# EasyEDA Pro project Electonic_keyboard.eprj

# Schematic Electonic Keyboard
Create Date: 2023-12-27; Page Name: P1; Project Name: Electonic_keyboard; Schematic Name: Electonic Keyboard; Update Date: 2024-01-06; Company: 嘉立创EDA; Drawed: Cameron Bright; Page Size: A4; Reviewed: Cameron Bright; Version: V1.0
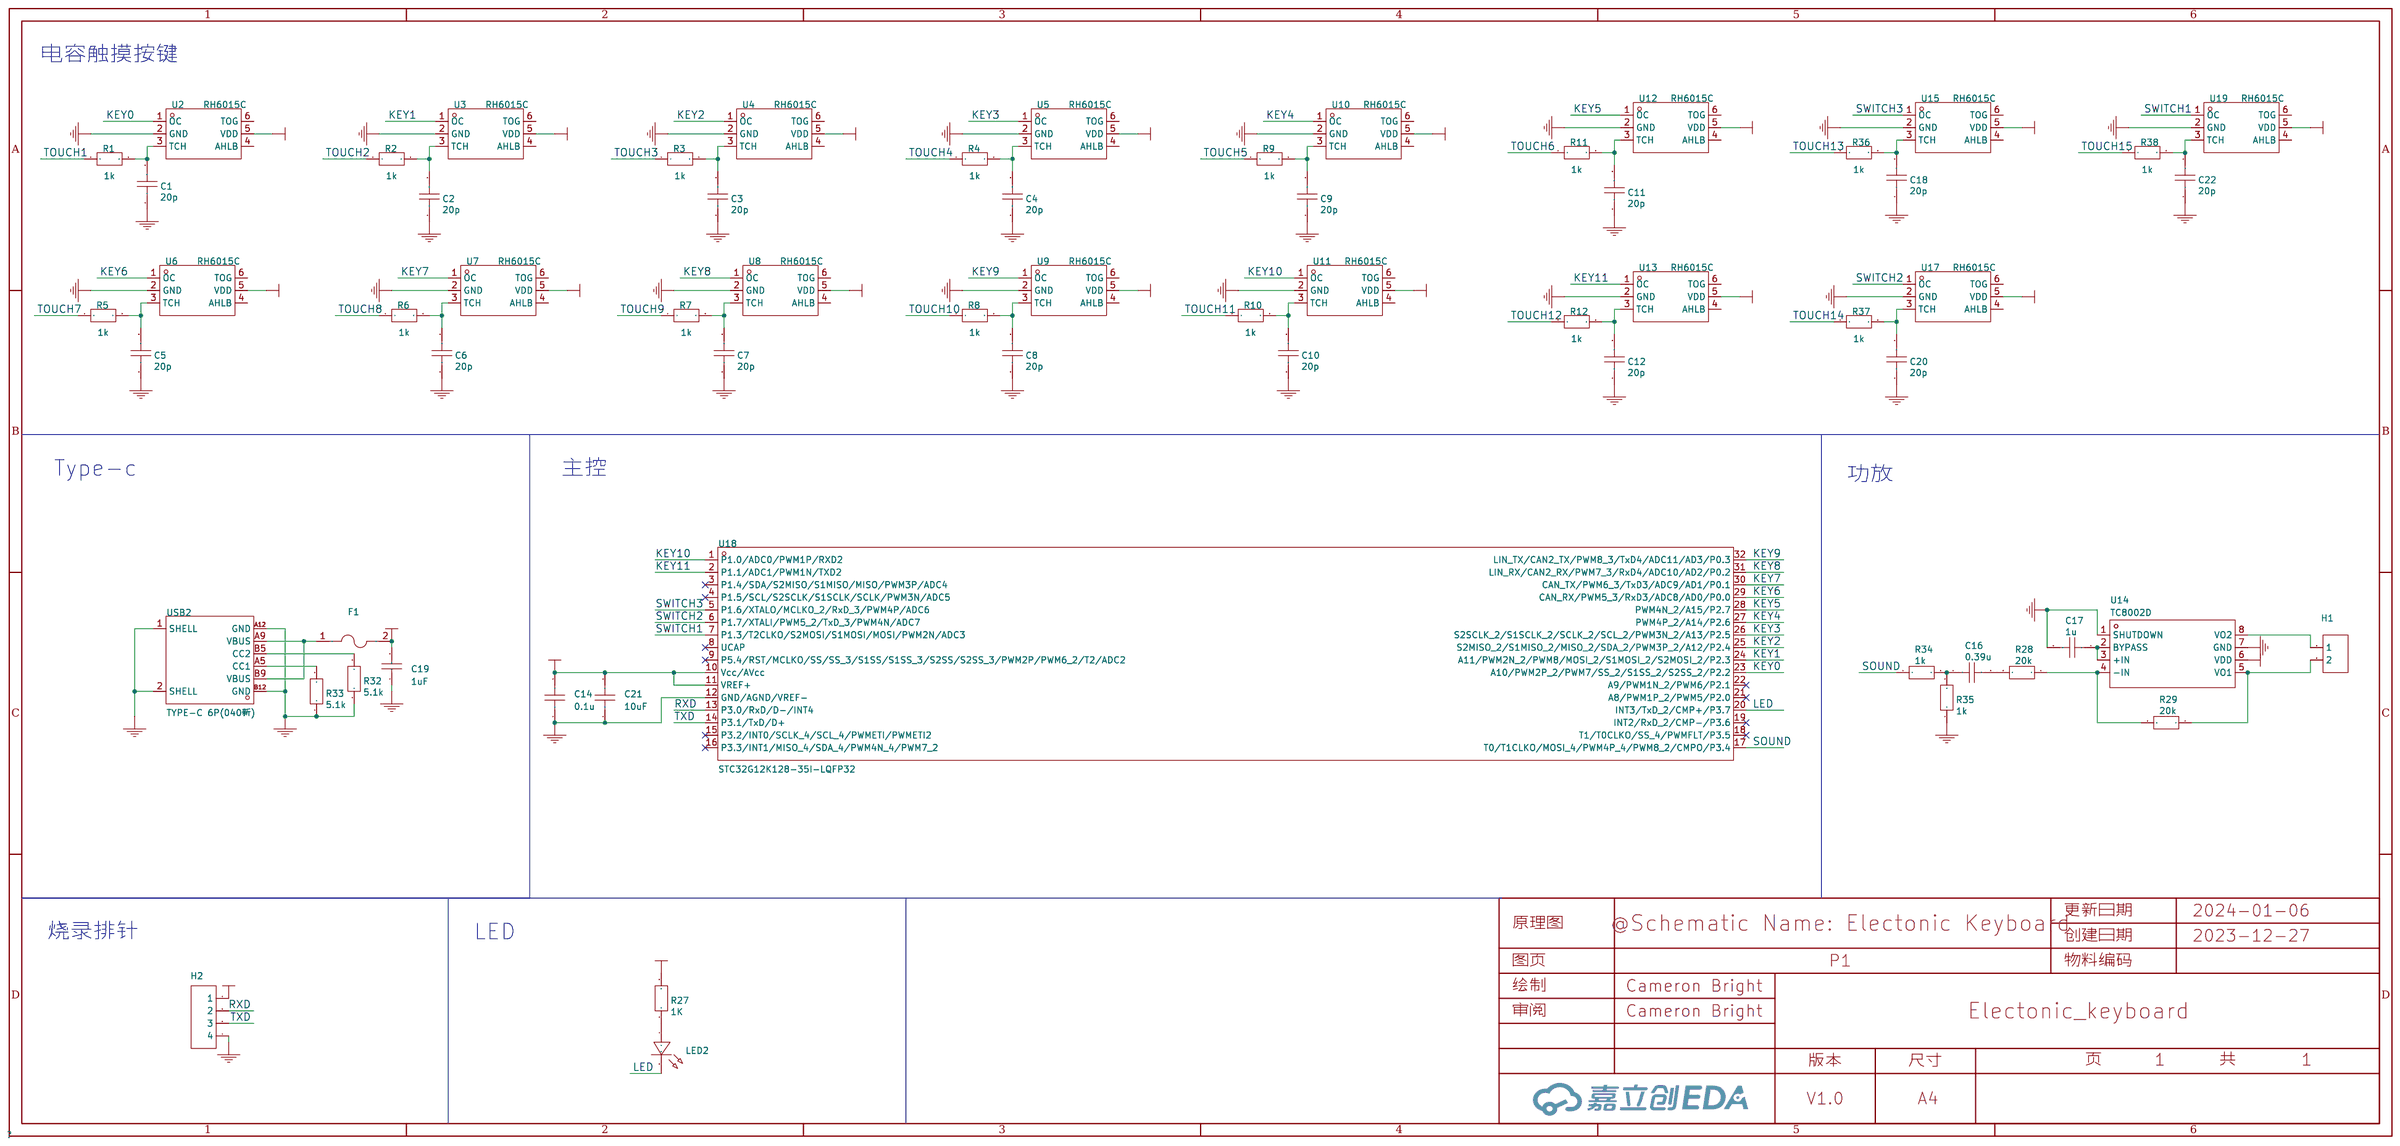
[diagram p0: schematic sheet]

## Parts
C1  20p  [C0603]
C2  20p  [C0603]
C3  20p  [C0603]
C4  20p  [C0603]
C5  20p  [C0603]
C6  20p  [C0603]
C7  20p  [C0603]
C8  20p  [C0603]
C9  20p  [C0603]
C10  20p  [C0603]
C11  20p  [C0603]
C12  20p  [C0603]
C14  0.1u  [C0603]
C16  0.39u  [C0603]
C17  1u  [C0603]
C18  20p  [C0603]
C19  1uF  [C0603]
C20  20p  [C0603]
C21  10uF  [C0603]
C22  20p  [C0603]
F1  ASMD0805-050  [F0805]
H1  HDR-F-2.54_1x2  [HDR-F-2.54_1X2]
H2  HDR-F-2.54_1x4  [HDR-F-2.54_1X4]
LED2  NCD0603R1  [LED0603-RD_RED]
R1  1k  [C0603]
R2  1k  [C0603]
R3  1k  [C0603]
R4  1k  [C0603]
R5  1k  [C0603]
R6  1k  [C0603]
R7  1k  [C0603]
R8  1k  [C0603]
R9  1k  [C0603]
R10  1k  [C0603]
R11  1k  [C0603]
R12  1k  [C0603]
R27  1K  [C0603]
R28  20k  [C0603]
R29  20k  [C0603]
R32  5.1k  [C0603]
R33  5.1k  [C0603]
R34  1k  [C0603]
R35  1k  [C0603]
R36  1k  [C0603]
R37  1k  [C0603]
R38  1k  [C0603]
U2  RH6015C  [SOT-23-6_L2.9-W1.6-P0.95-LS2.8-BR]
U3  RH6015C  [SOT-23-6_L2.9-W1.6-P0.95-LS2.8-BR]
U4  RH6015C  [SOT-23-6_L2.9-W1.6-P0.95-LS2.8-BR]
U5  RH6015C  [SOT-23-6_L2.9-W1.6-P0.95-LS2.8-BR]
U6  RH6015C  [SOT-23-6_L2.9-W1.6-P0.95-LS2.8-BR]
U7  RH6015C  [SOT-23-6_L2.9-W1.6-P0.95-LS2.8-BR]
U8  RH6015C  [SOT-23-6_L2.9-W1.6-P0.95-LS2.8-BR]
U9  RH6015C  [SOT-23-6_L2.9-W1.6-P0.95-LS2.8-BR]
U10  RH6015C  [SOT-23-6_L2.9-W1.6-P0.95-LS2.8-BR]
U11  RH6015C  [SOT-23-6_L2.9-W1.6-P0.95-LS2.8-BR]
U12  RH6015C  [SOT-23-6_L2.9-W1.6-P0.95-LS2.8-BR]
U13  RH6015C  [SOT-23-6_L2.9-W1.6-P0.95-LS2.8-BR]
U14  TC8002D  [SOIC-8_L5.0-W4.0-P1.27-LS6.0-BL]
U15  RH6015C  [SOT-23-6_L2.9-W1.6-P0.95-LS2.8-BR]
U17  RH6015C  [SOT-23-6_L2.9-W1.6-P0.95-LS2.8-BR]
U18  STC32G12K128-35I-LQFP32  [LQFP-32_L7.0-W7.0-P0.80-LS9.0-BL]
U19  RH6015C  [SOT-23-6_L2.9-W1.6-P0.95-LS2.8-BR]
USB2  TYPE-C 6P(040新)  [USB-C-SMD_TYPE-C-6P]

## Library data of the parts
C1-C12 C18 C20 C22 = 20p
C14 = 0.1u
C16 = 0.39u
C17 = 1u
C19 = CL10A105KB8NNNC: 容值:1uF;精度:±10%;额定电压:50V;材质(温度系数):X5R;; LCSC Part Name: 1uF ±10% 50V; Supplier Part: C15849; Manufacturer: SAMSUNG(三星); Supplier Footprint: 0603; JLCPCB Part Class: 基础库; Datasheet: https://atta.szlcsc.com/upload/public/pdf/source/20160218/1457707763339.pdf; Supplier: LCSC; Tolerance: ±10%; Voltage Rated: 50V; Temperature Coefficient: X5R
C21 = CAP_0603: Supplier Footprint: 0603
F1 = ASMD0805-050: 最大电压:6V;最大电流:100A;保持电流:500mA;跳闸电流:1A;; LCSC Part Name: 6V 500mA 0805自恢复; Supplier Part: C135329; Manufacturer: JDTfuse(集电通); Supplier Footprint: 0805; JLCPCB Part Class: Extended Part; Datasheet: https://atta.szlcsc.com/upload/public/pdf/source/20171014/C135329_15079756460221038400.pdf; Supplier: LCSC; Operating Voltage (Max): 6V; Current Rating (Max): 100A; Hold Current: 500mA; Trip Current: 1A; Power Dissipation: 500mW; Resistance - Initial (Ri) (Min): 150mΩ; Resistance - Post Trip (R1) (Max): 850mΩ; Maximum Time to Trip: 100ms; Operating Temperature: -40℃~+85℃
H1 = HDR-F-2.54_1x2: Supplier Part: C49661; Supplier: LCSC
H2 = HDR-F-2.54_1x4: Supplier Part: C225501; Supplier: LCSC
LED2 = NCD0603R1_C84263: 发光颜色:红色;功率:65mW;透镜颜色:无色透明;主波长:615nm~630nm;发光强度:80mcd~220mcd;发光角度:130°;工作温度:-30℃~+85℃;; LCSC Part Name: 红灯 0603红灯   正贴; Supplier Part: C84263; Manufacturer: 国星光电; Supplier Footprint: 0603; JLCPCB Part Class: Extended Part; Datasheet: https://atta.szlcsc.com/upload/public/pdf/source/20200820/C84263_DABC6A75E58F576973B407FDBA283D60.pdf; Supplier: LCSC; Emitted Color: 红色; Forward Voltage (VF): 1.6V~2.6V; Forward Current: 20mA; Power Dissipation: 65mW; Lens Color: 无色透明; Dominant Wavelength: 615nm~630nm; Luminous Intensity: 80mcd~220mcd; Viewing Angle: 130°; Operating Temperature: -30℃~+85℃
R1-R12 R34-R38 = 1k
R27 = 1K
R28 R29 = 20k
R32 R33 = 5.1k
U2-U13 U15 U17 U19 = RH6015C: Supplier: LCSC; Supplier Part: C161821; Manufacturer: RONGHE Microelectronics; JLCPCB Part Class: Extend
U14 = TC8002D: 功放类型:-;扬声器通道数:1通道(单声道);输出功率:3Wx1@3Ω;; Supplier Part: C87265; Manufacturer: FM(富满); Supplier Footprint: SOIC-8; JLCPCB Part Class: Extended Part; Datasheet: https://atta.szlcsc.com/upload/public/pdf/source/20161123/1479873101876.pdf; Supplier: LCSC; Speaker Channels: 1通道(单声道); Output Power: 3Wx1@3Ω; Supply Voltage: 2V~5.5V
U18 = STC32G12K128-35I-LQFP32: Supplier Part: C5210759; Manufacturer: STC(宏晶); Supplier Footprint: LQFP-32(7x7); JLCPCB Part Class: 扩展库; Datasheet: https://atta.szlcsc.com/upload/public/pdf/source/20230914/AA8E7D278420EC7FE3821FDFD9AB7FC5.pdf; Supplier: LCSC
USB2 = TYPE-C 6P(040新): 连接器类型:Type-C;标准:-;公母:母;端口数量:1;触点数量:6P;安装方式:卧贴;额定电流 - 电源:3A;工作温度范围:-40℃~+85℃;; LCSC Part Name: Type-C 母 卧贴 外壳带丝印; Supplier Part: C2887422; Manufacturer: SHOU HAN(首韩); Supplier Footprint: SMD; JLCPCB Part Class: 扩展库; Datasheet: https://atta.szlcsc.com/upload/public/pdf/source/20210820/A6D4675B44FEA528A0512D7C06DEA92E.pdf; Supplier: LCSC; Connector Type: Type-C; Gender: 母; Number of Ports: 1; Number of Contacts: 6P; Mounting Style: 卧贴; Current Rating - Power (Max): 3A; Operating Temperature Range: -40℃~+85℃

## Nets
GND: C1.1 C2.1 C3.1 C4.1 C5.1 C6.1 C7.1 C8.1 C9.1 C10.1 C11.1 C12.1 C14.1 C17.2 C18.1 C19.1 C20.1 C21.1 C22.1 H2.4 R32.1 R33.1 R35.1 U2.2(GND) U3.2(GND) U4.2(GND) U5.2(GND) U6.2(GND) U7.2(GND) U8.2(GND) U9.2(GND) U10.2(GND) U11.2(GND) U12.2(GND) U13.2(GND) U14.1(SHUTDOWN) U14.7(GND) U15.2(GND) U17.2(GND) U18.12(GND/AGND/VREF-) U19.2(GND) USB2.1(SHELL) USB2.2(SHELL) USB2.A12(GND) USB2.B12(GND)
VCC: C14.2 C19.2 C21.2 F1.2 H2.1 R27.2 U2.5(VDD) U3.5(VDD) U4.5(VDD) U5.5(VDD) U6.5(VDD) U7.5(VDD) U8.5(VDD) U9.5(VDD) U10.5(VDD) U11.5(VDD) U12.5(VDD) U13.5(VDD) U14.6(VDD) U15.5(VDD) U17.5(VDD) U18.10(Vcc/AVcc) U18.11(VREF+) U19.5(VDD)
KEY0: U2.1(OC) U18.23(A10/PWM2P_2/PWM7/SS_2/S1SS_2/S2SS_2/P2.2)
KEY1: U3.1(OC) U18.24(A11/PWM2N_2/PWM8/MOSI_2/S1MOSI_2/S2MOSI_2/P2.3)
KEY2: U4.1(OC) U18.25(S2MISO_2/S1MISO_2/MISO_2/SDA_2/PWM3P_2/A12/P2.4)
KEY3: U5.1(OC) U18.26(S2SCLK_2/S1SCLK_2/SCLK_2/SCL_2/PWM3N_2/A13/P2.5)
KEY4: U10.1(OC) U18.27(PWM4P_2/A14/P2.6)
KEY5: U12.1(OC) U18.28(PWM4N_2/A15/P2.7)
KEY6: U6.1(OC) U18.29(CAN_RX/PWM5_3/RxD3/ADC8/AD0/P0.0)
KEY7: U7.1(OC) U18.30(CAN_TX/PWM6_3/TxD3/ADC9/AD1/P0.1)
KEY8: U8.1(OC) U18.31(LIN_RX/CAN2_RX/PWM7_3/RxD4/ADC10/AD2/P0.2)
KEY9: U9.1(OC) U18.32(LIN_TX/CAN2_TX/PWM8_3/TxD4/ADC11/AD3/P0.3)
KEY10: U11.1(OC) U18.1(P1.0/ADC0/PWM1P/RXD2)
KEY11: U13.1(OC) U18.2(P1.1/ADC1/PWM1N/TXD2)
LED: LED2.2 U18.20(INT3/TxD_2/CMP+/P3.7)
RXD: H2.2 U18.13(P3.0/RxD/D-/INT4)
SOUND: R34.1 U18.17(T0/T1CLKO/MOSI_4/PWM4P_4/PWM8_2/CMPO/P3.4)
SWITCH1: U18.7(P1.3/T2CLKO/S2MOSI/S1MOSI/MOSI/PWM2N/ADC3) U19.1(OC)
SWITCH2: U17.1(OC) U18.6(P1.7/XTALI/PWM5_2/TxD_3/PWM4N/ADC7)
SWITCH3: U15.1(OC) U18.5(P1.6/XTALO/MCLKO_2/RxD_3/PWM4P/ADC6)
TOUCH1: R1.1
TOUCH2: R2.1
TOUCH3: R3.1
TOUCH4: R4.1
TOUCH5: R9.1
TOUCH6: R11.1
TOUCH7: R5.1
TOUCH8: R6.1
TOUCH9: R7.1
TOUCH10: R8.1
TOUCH11: R10.1
TOUCH12: R12.1
TOUCH13: R36.1
TOUCH14: R37.1
TOUCH15: R38.1
TXD: H2.3 U18.14(P3.1/TxD/D+)
$1N1124: C1.2 R1.2 U2.3(TCH)
$1N1133: C2.2 R2.2 U3.3(TCH)
$1N1138: C3.2 R3.2 U4.3(TCH)
$1N1145: C4.2 R4.2 U5.3(TCH)
$1N1152: C5.2 R5.2 U6.3(TCH)
$1N1159: C6.2 R6.2 U7.3(TCH)
$1N1166: C7.2 R7.2 U8.3(TCH)
$1N1173: C8.2 R8.2 U9.3(TCH)
$1N1180: C9.2 R9.2 U10.3(TCH)
$1N1187: C10.2 R10.2 U11.3(TCH)
$1N1448: C11.2 R11.2 U12.3(TCH)
$1N1455: C12.2 R12.2 U13.3(TCH)
$1N1642: R33.2 USB2.A5(CC1)
$1N1644: F1.1 USB2.A9(VBUS) USB2.B9(VBUS)
$1N1645: R32.2 USB2.B5(CC2)
$1N1710: LED2.1 R27.1
$1N2160: H1.2 R29.1 U14.5(VO1)
$1N2161: R28.1 R29.2 U14.4(-IN)
$1N2162: H1.1 U14.8(VO2)
$1N2164: C17.1 U14.2(BYPASS) U14.3(+IN)
$1N2169: C16.1 R34.2 R35.2
$1N2171: C16.2 R28.2
$1N8905: C18.2 R36.2 U15.3(TCH)
$1N12216: C20.2 R37.2 U17.3(TCH)
$1N14986: C22.2 R38.2 U19.3(TCH)

Not connected (* = marked no-connect by the designer): U2 4(AHLB) 6(TOG); U3 4(AHLB) 6(TOG); U4 4(AHLB) 6(TOG); U5 4(AHLB) 6(TOG); U6 4(AHLB) 6(TOG); U7 4(AHLB) 6(TOG); U8 4(AHLB) 6(TOG); U9 4(AHLB) 6(TOG); U10 4(AHLB) 6(TOG); U11 4(AHLB) 6(TOG); U12 4(AHLB) 6(TOG); U13 4(AHLB) 6(TOG); U15 4(AHLB) 6(TOG); U17 4(AHLB) 6(TOG); U18 3(P1.4/SDA/S2MISO/S1MISO/MISO/PWM3P/ADC4)* 4(P1.5/SCL/S2SCLK/S1SCLK/SCLK/PWM3N/ADC5)* 8(UCAP)* 9(P5.4/RST/MCLKO/SS/SS_3/S1SS/S1SS_3/S2SS/S2SS_3/PWM2P/PWM6_2/T2/ADC2)* 15(P3.2/INT0/SCLK_4/SCL_4/PWMETI/PWMETI2)* 16(P3.3/INT1/MISO_4/SDA_4/PWM4N_4/PWM7_2)* 18(T1/T0CLKO/SS_4/PWMFLT/P3.5)* 19(INT2/RxD_2/CMP-/P3.6)* 21(A8/PWM1P_2/PWM5/P2.0)* 22(A9/PWM1N_2/PWM6/P2.1)*; U19 4(AHLB) 6(TOG)

## Notes on the sheet
- 电容触摸按键
- Type-c
- 主控
- 功放
- 烧录排针
- LED

# Schematic 迷你电子琴
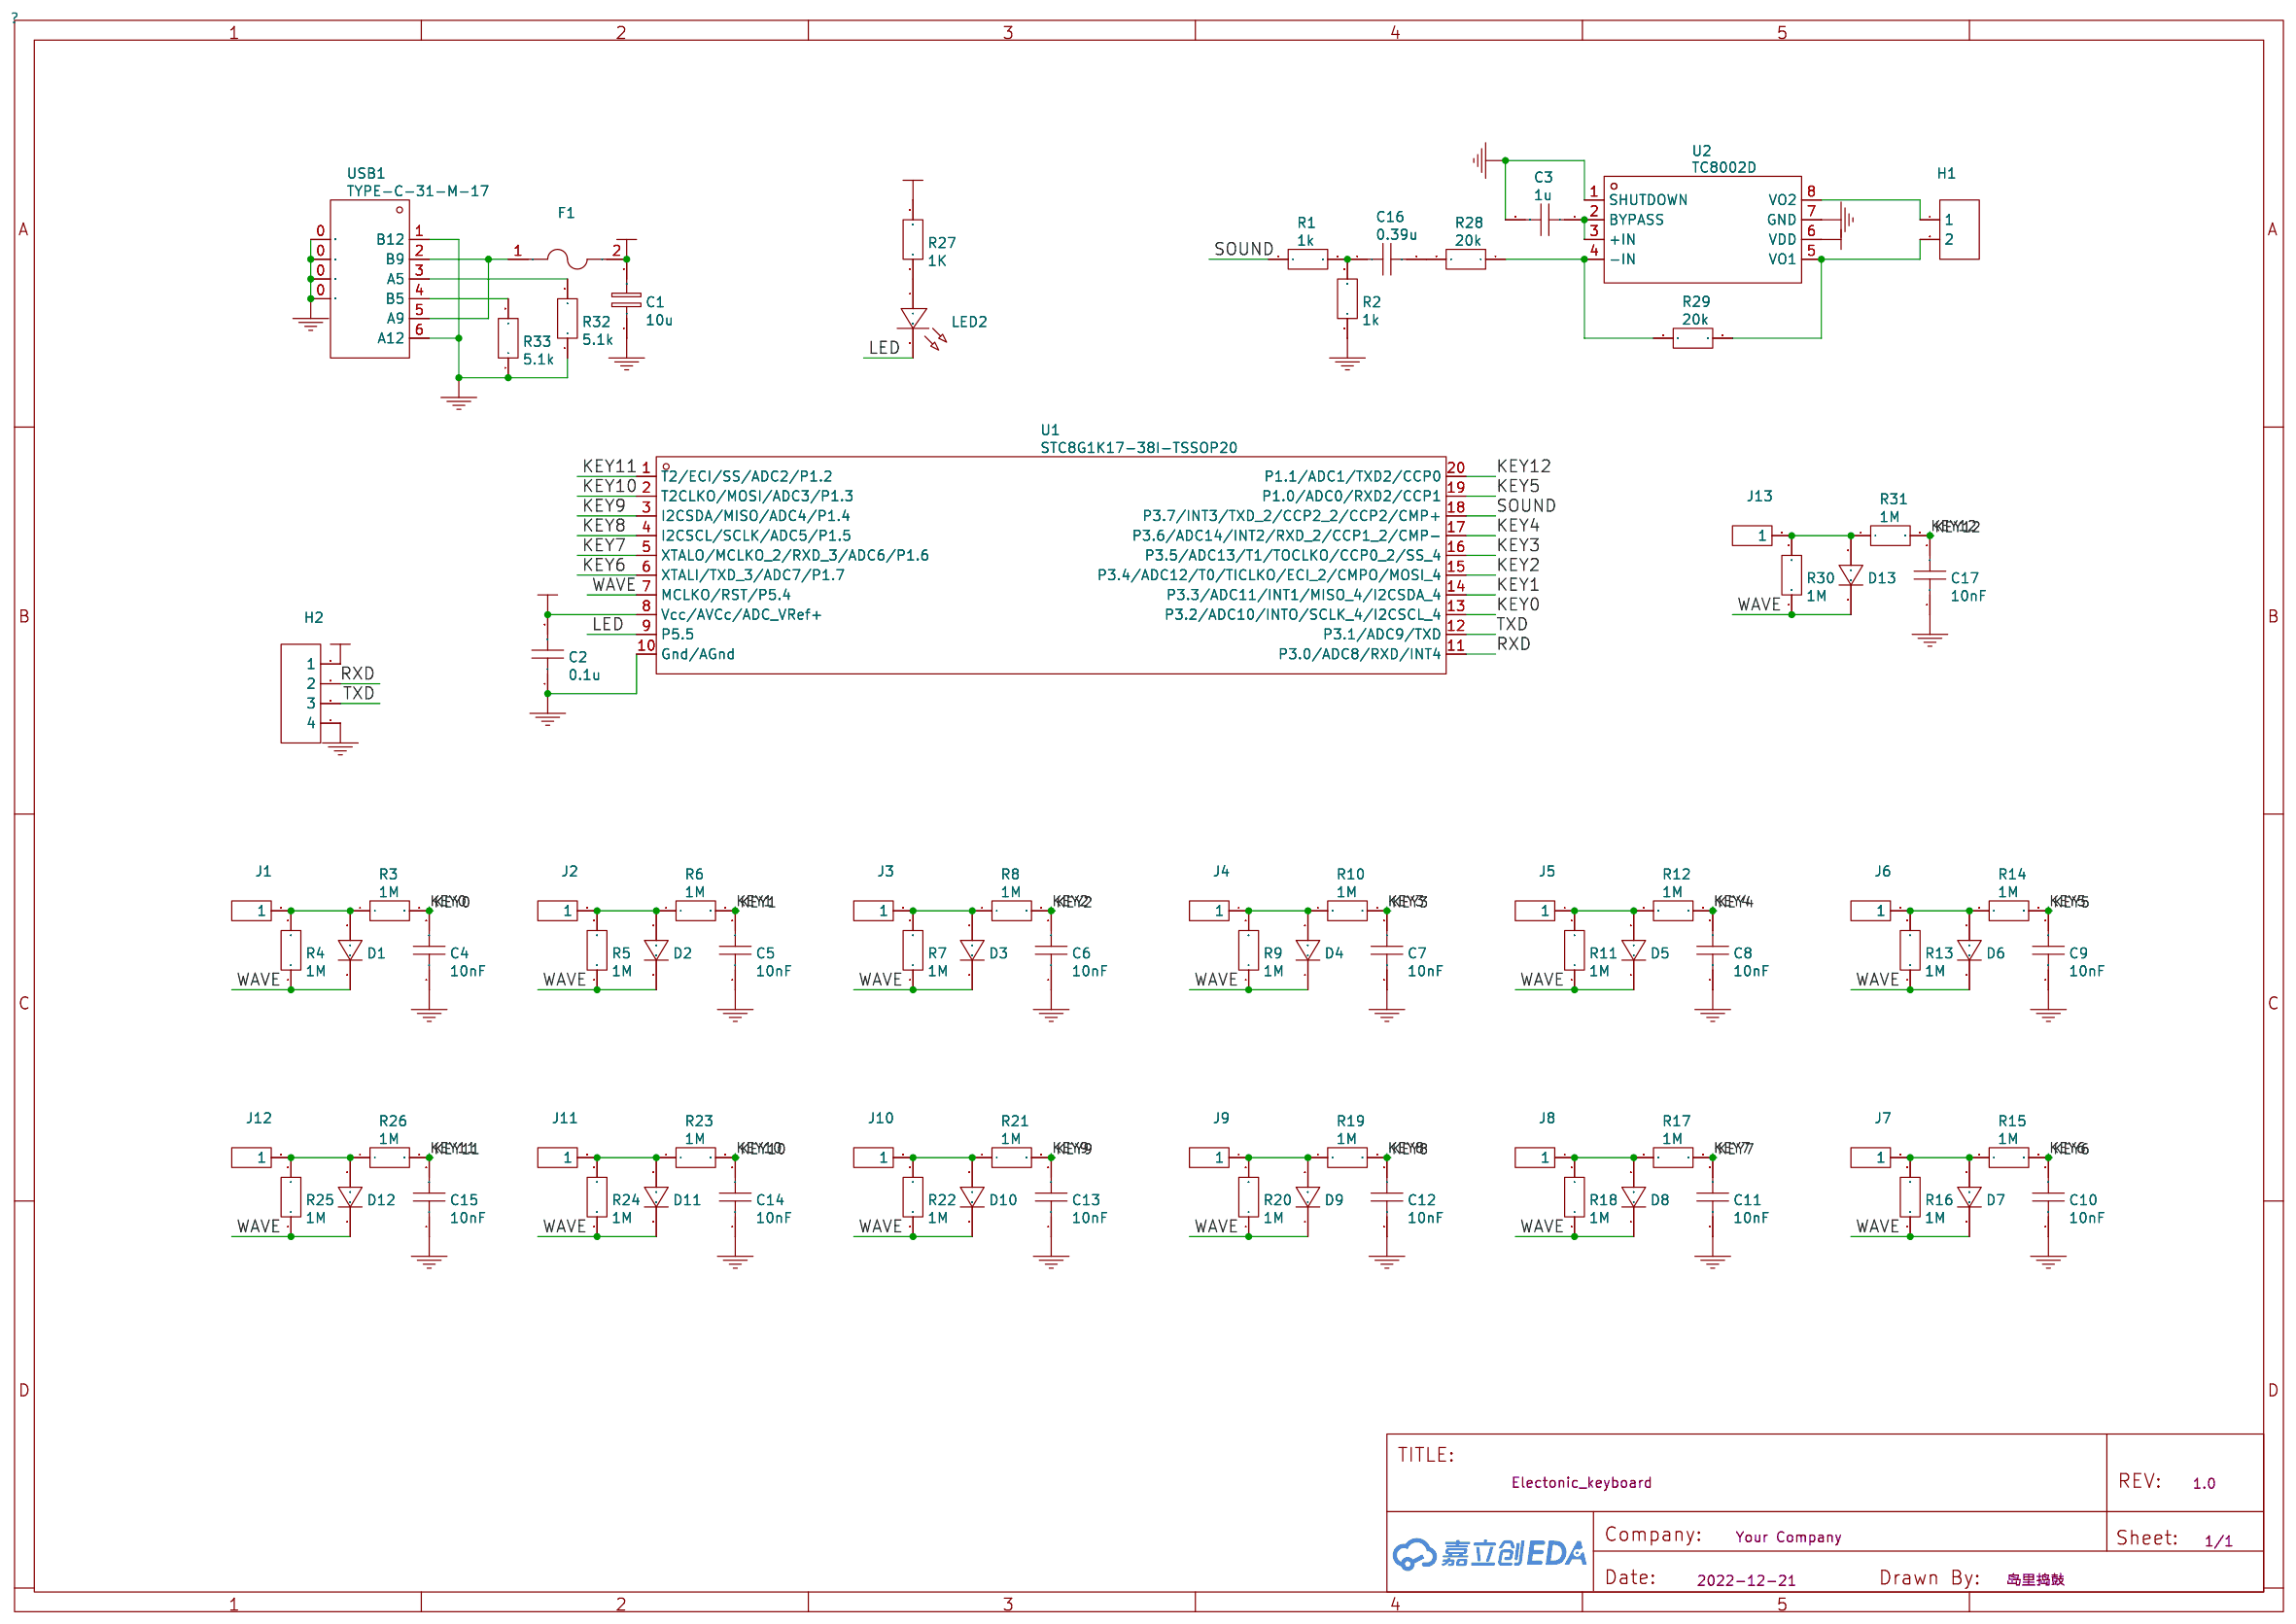
[diagram p1: schematic sheet]

## Parts
C1  10u
C2  0.1u
C3  1u
C4  10nF
C5  10nF
C6  10nF
C7  10nF
C8  10nF
C9  10nF
C10  10nF
C11  10nF
C12  10nF
C13  10nF
C14  10nF
C15  10nF
C16  0.39u
C17  10nF
D1  1N4148W
D2  1N4148W
D3  1N4148W
D4  1N4148W
D5  1N4148W
D6  1N4148W
D7  1N4148W
D8  1N4148W
D9  1N4148W
D10  1N4148W
D11  1N4148W
D12  1N4148W
D13  1N4148W
F1  ASMD0805-050
H1  HDR-F-2.54_1x2
H2  HDR-F-2.54_1x4
J1  HDR-M-2.54_1x1
J2  HDR-M-2.54_1x1
J3  HDR-M-2.54_1x1
J4  HDR-M-2.54_1x1
J5  HDR-M-2.54_1x1
J6  HDR-M-2.54_1x1
J7  HDR-M-2.54_1x1
J8  HDR-M-2.54_1x1
J9  HDR-M-2.54_1x1
J10  HDR-M-2.54_1x1
J11  HDR-M-2.54_1x1
J12  HDR-M-2.54_1x1
J13  HDR-M-2.54_1x1
LED2  LED-0805_R
R1  1k
R2  1k
R3  1M
R4  1M
R5  1M
R6  1M
R7  1M
R8  1M
R9  1M
R10  1M
R11  1M
R12  1M
R13  1M
R14  1M
R15  1M
R16  1M
R17  1M
R18  1M
R19  1M
R20  1M
R21  1M
R22  1M
R23  1M
R24  1M
R25  1M
R26  1M
R27  1K
R28  20k
R29  20k
R30  1M
R31  1M
R32  5.1k
R33  5.1k
U1  STC8G1K17-38I-TSSOP20
U2  TC8002D
USB1  TYPE-C-31-M-17

## Library data of the parts
C1 = 10u
C2 = 0.1u
C3 = 1u
C4-C15 C17 = 10nF
C16 = 0.39u
D1-D13 = 1N4148W: Supplier: LCSC; Manufacturer: Tak Cheong; Supplier Part: C129216
F1 = ASMD0805-050: Supplier: LCSC; Manufacturer: JDTFUSE; Supplier Part: C135329; JLCPCB Part Class: Extended Part
H1 = HDR-F-2.54_1x2: Supplier Part: C49661; Supplier: LCSC
H2 = HDR-F-2.54_1x4: Supplier Part: C225501; Supplier: LCSC
J1-J13 = HDR-M-2.54_1x1: Supplier Part: C81276; Supplier: LCSC
LED2 = LED-0805_R: Manufacturer: EVERLIGHT(台湾亿光); Manufacturer Part: 17-21SURC/S530-A3/TR8; Supplier Part: C72037
R1 R2 = 1k
R3-R26 R30 R31 = 1M
R27 = 1K
R28 R29 = 20k
R32 R33 = 5.1k
U1 = STC8G1K17-38I-TSSOP20: Supplier: LCSC; Supplier Part: C521759; Manufacturer: STC Micro; JLCPCB Part Class: Extended Part
U2 = TC8002D: Supplier: LCSC; Manufacturer: FM(富满); Supplier Part: C87265; JLCPCB Part Class: Extended Part
USB1 = TYPE-C-31-M-17: Supplier: LCSC; Supplier Part: C283540; Manufacturer: Korean Hroparts Elec; JLCPCB Part Class: Extended Part

## Nets
GND: C1.1 C2.1 C3.2 C4.1 C5.1 C6.1 C7.1 C8.1 C9.1 C10.1 C11.1 C12.1 C13.1 C14.1 C15.1 C17.1 H2.4 R2.1 R32.1 R33.1 U1.10(Gnd/AGnd) U2.1(SHUTDOWN) U2.7(GND) USB1.0 USB1.1(B12) USB1.6(A12)
VCC: C1.2 C2.2 F1.2 H2.1 R27.2 U1.8(Vcc/AVCc/ADC_VRef+) U2.6(VDD)
KEY0: C4.2 R3.2 U1.13(P3.2/ADC10/INTO/SCLK_4/I2CSCL_4)
KEY1: C5.2 R6.2 U1.14(P3.3/ADC11/INT1/MISO_4/I2CSDA_4)
KEY2: C6.2 R8.2 U1.15(P3.4/ADC12/T0/TICLKO/ECI_2/CMPO/MOSI_4)
KEY3: C7.2 R10.2 U1.16(P3.5/ADC13/T1/TOCLKO/CCP0_2/SS_4)
KEY4: C8.2 R12.2 U1.17(P3.6/ADC14/INT2/RXD_2/CCP1_2/CMP-)
KEY5: C9.2 R14.2 U1.19(P1.0/ADC0/RXD2/CCP1)
KEY6: C10.2 R15.2 U1.6(XTALI/TXD_3/ADC7/P1.7)
KEY7: C11.2 R17.2 U1.5(XTALO/MCLKO_2/RXD_3/ADC6/P1.6)
KEY8: C12.2 R19.2 U1.4(I2CSCL/SCLK/ADC5/P1.5)
KEY9: C13.2 R21.2 U1.3(I2CSDA/MISO/ADC4/P1.4)
KEY10: C14.2 R23.2 U1.2(T2CLKO/MOSI/ADC3/P1.3)
KEY11: C15.2 R26.2 U1.1(T2/ECI/SS/ADC2/P1.2)
KEY12: C17.2 R31.2 U1.20(P1.1/ADC1/TXD2/CCP0)
LED: LED2.2 U1.9(P5.5)
RXD: H2.2 U1.11(P3.0/ADC8/RXD/INT4)
SOUND: R1.1 U1.18(P3.7/INT3/TXD_2/CCP2_2/CCP2/CMP+)
TXD: H2.3 U1.12(P3.1/ADC9/TXD)
WAVE: D1.1 D2.1 D3.1 D4.1 D5.1 D6.1 D7.1 D8.1 D9.1 D10.1 D11.1 D12.1 D13.1 R4.1 R5.1 R7.1 R9.1 R11.1 R13.1 R16.1 R18.1 R20.1 R22.1 R24.1 R25.1 R30.1 U1.7(MCLKO/RST/P5.4)
Net-(C3-1): C3.1 U2.2(BYPASS) U2.3(+IN)
Net-(C16-1): C16.1 R1.2 R2.2
Net-(C16-2): C16.2 R28.2
Net-(D1-2): D1.2 J1.1 R3.1 R4.2
Net-(D2-2): D2.2 J2.1 R5.2 R6.1
Net-(D3-2): D3.2 J3.1 R7.2 R8.1
Net-(D4-2): D4.2 J4.1 R9.2 R10.1
Net-(D5-2): D5.2 J5.1 R11.2 R12.1
Net-(D6-2): D6.2 J6.1 R13.2 R14.1
Net-(D7-2): D7.2 J7.1 R15.1 R16.2
Net-(D8-2): D8.2 J8.1 R17.1 R18.2
Net-(D9-2): D9.2 J9.1 R19.1 R20.2
Net-(D10-2): D10.2 J10.1 R21.1 R22.2
Net-(D11-2): D11.2 J11.1 R23.1 R24.2
Net-(D12-2): D12.2 J12.1 R25.2 R26.1
Net-(D13-2): D13.2 J13.1 R30.2 R31.1
Net-(F1-1): F1.1 USB1.2(B9) USB1.5(A9)
Net-(H1-1): H1.1 U2.8(VO2)
Net-(H1-2): H1.2 R29.1 U2.5(VO1)
Net-(LED2-1): LED2.1 R27.1
Net-(R28-1): R28.1 R29.2 U2.4(-IN)
Net-(R32-2): R32.2 USB1.3(A5)
Net-(R33-2): R33.2 USB1.4(B5)

# Schematic Mini_Piano
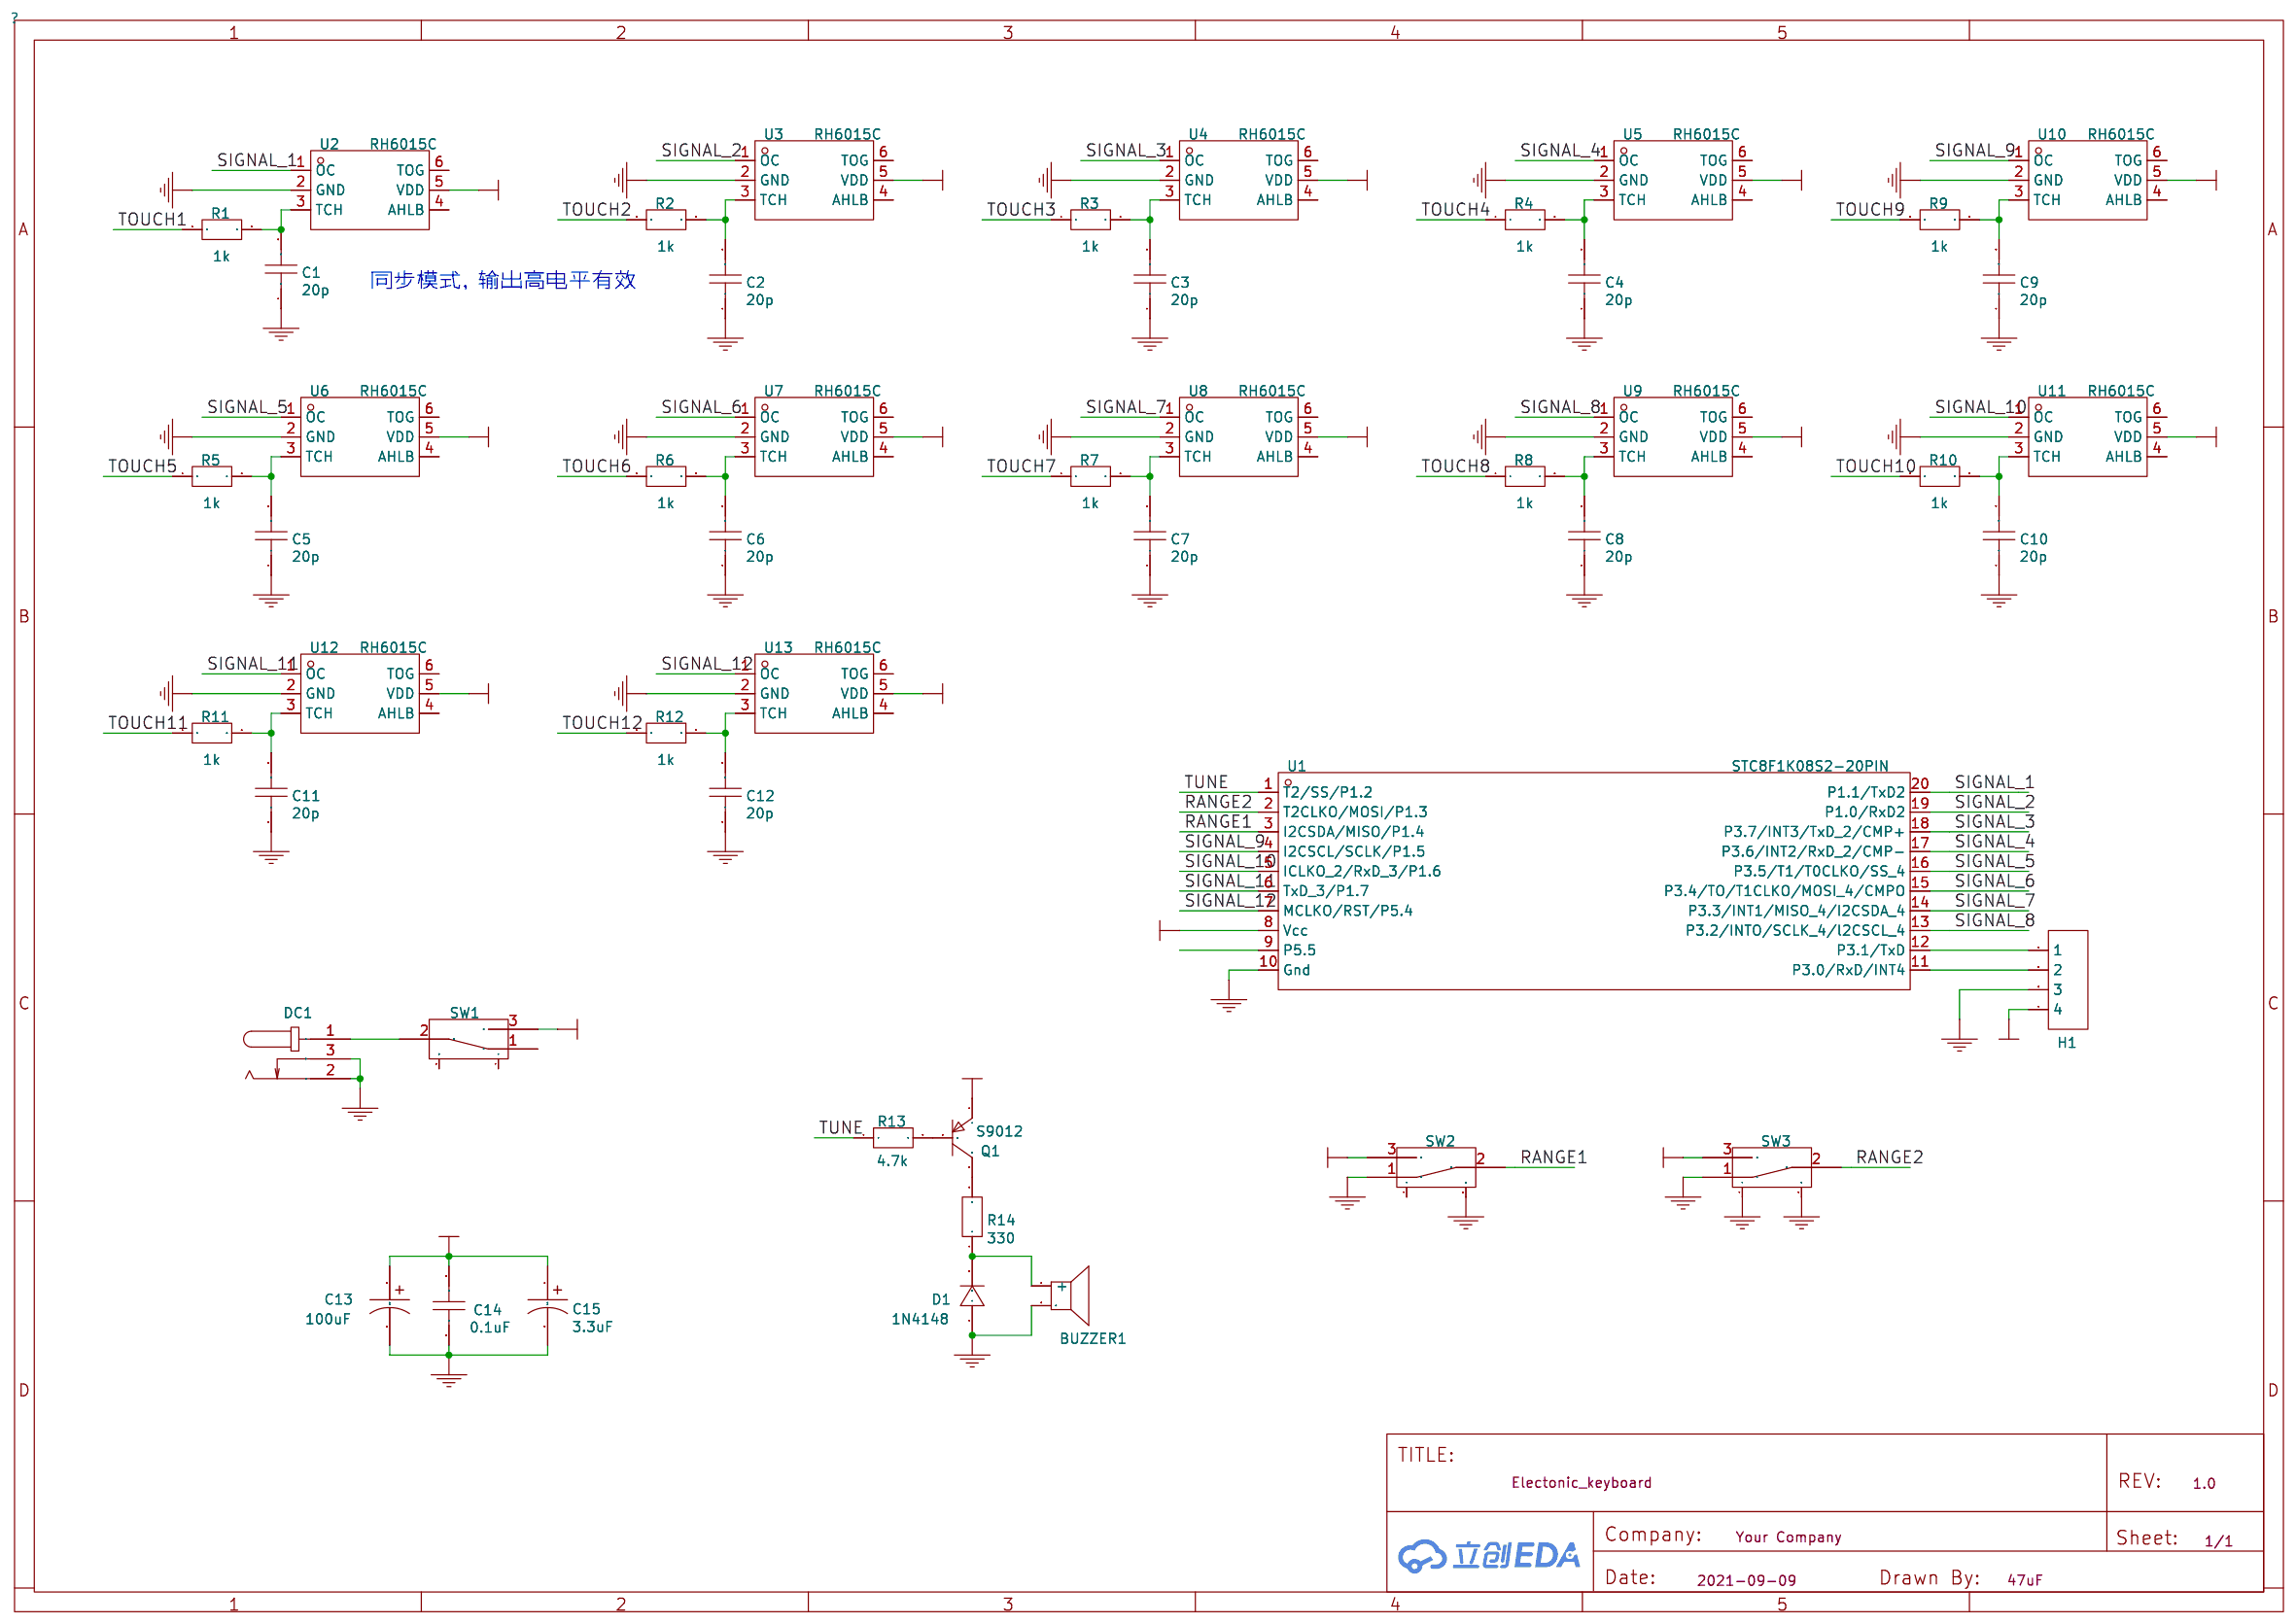
[diagram p2: schematic sheet]

## Parts
BUZZER1  SUN-12095-5VPA7.6
C1  20p
C2  20p
C3  20p
C4  20p
C5  20p
C6  20p
C7  20p
C8  20p
C9  20p
C10  20p
C11  20p
C12  20p
C13  100uF
C14  0.1uF
C15  3.3uF
D1  1N4148
DC1  DC005-T
H1  HDR-F-2.54_1x4
Q1  S9012
R1  1k
R2  1k
R3  1k
R4  1k
R5  1k
R6  1k
R7  1k
R8  1k
R9  1k
R10  1k
R11  1k
R12  1k
R13  4.7k
R14  330
SW1  SK-12D02-VG5
SW2  SK-12D02-VG5
SW3  SK-12D02-VG5
U1  STC8F1K08S2-20PIN
U2  RH6015C
U3  RH6015C
U4  RH6015C
U5  RH6015C
U6  RH6015C
U7  RH6015C
U8  RH6015C
U9  RH6015C
U10  RH6015C
U11  RH6015C
U12  RH6015C
U13  RH6015C

## Library data of the parts
BUZZER1 = SUN-12095-5VPA7.6: Supplier: LCSC; Supplier Part: C360615; Manufacturer: S&amp;S; JLCPCB Part Class: Extended Part
C1-C12 = 20p
C13 = 100uF
C14 = 0.1uF
C15 = 3.3uF
D1 = 1N4148: Supplier: LCSC; Manufacturer: SEMTECH; Supplier Part: C14516
DC1 = DC005-T: Supplier: LCSC; Supplier Part: C431532; Manufacturer: SHOU HAN; JLCPCB Part Class: Extended Part
H1 = HDR-F-2.54_1x4: Supplier Part: C225501; Supplier: LCSC
Q1 = S9012: Supplier: LCSC; Manufacturer: KEC; Manufacturer Part: 2N3906S-RTK/PS; Supplier Part: C147294
R1-R12 = 1k
R13 = 4.7k
R14 = 330
SW1-SW3 = SK-12D02-VG5: Supplier: LCSC; Supplier Part: C136722; Manufacturer: Rectangular Connectors - Contacts
U1 = STC8F1K08S2-20PIN: Supplier: LCSC; Supplier Part: C2835636; Manufacturer: null; Manufacturer Part: STC8F1K08S2-20pin; JLCPCB Part Class: Extended Part
U2-U13 = RH6015C: Supplier: LCSC; Supplier Part: C161821; Manufacturer: RONGHE Microelectronics; JLCPCB Part Class: Extend

## Nets
GND: BUZZER1.2 C1.1 C2.1 C3.1 C4.1 C5.1 C6.1 C7.1 C8.1 C9.1 C10.1 C11.1 C12.1 C13.2 C14.1 C15.2 D1.1 DC1.2 DC1.3 H1.3 SW2.1 SW2.5 SW3.1 SW3.4 SW3.5 U1.10(Gnd) U2.2(GND) U3.2(GND) U4.2(GND) U5.2(GND) U6.2(GND) U7.2(GND) U8.2(GND) U9.2(GND) U10.2(GND) U11.2(GND) U12.2(GND) U13.2(GND)
VCC: C13.1 C14.2 C15.1 H1.4 Q1.1(E) SW1.3 SW2.3 SW3.3 U1.8(Vcc) U2.5(VDD) U3.5(VDD) U4.5(VDD) U5.5(VDD) U6.5(VDD) U7.5(VDD) U8.5(VDD) U9.5(VDD) U10.5(VDD) U11.5(VDD) U12.5(VDD) U13.5(VDD)
RANGE1: SW2.2 U1.3(I2CSDA/MISO/P1.4)
RANGE2: SW3.2 U1.2(T2CLKO/MOSI/P1.3)
SIGNAL_1: U1.20(P1.1/TxD2) U2.1(OC)
SIGNAL_2: U1.19(P1.0/RxD2) U3.1(OC)
SIGNAL_3: U1.18(P3.7/INT3/TxD_2/CMP+) U4.1(OC)
SIGNAL_4: U1.17(P3.6/INT2/RxD_2/CMP-) U5.1(OC)
SIGNAL_5: U1.16(P3.5/T1/T0CLKO/SS_4) U6.1(OC)
SIGNAL_6: U1.15(P3.4/TO/T1CLKO/MOSI_4/CMPO) U7.1(OC)
SIGNAL_7: U1.14(P3.3/INT1/MISO_4/I2CSDA_4) U8.1(OC)
SIGNAL_8: U1.13(P3.2/INTO/SCLK_4/l2CSCL_4) U9.1(OC)
SIGNAL_9: U1.4(I2CSCL/SCLK/P1.5) U10.1(OC)
SIGNAL_10: U1.5(ICLKO_2/RxD_3/P1.6) U11.1(OC)
SIGNAL_11: U1.6(TxD_3/P1.7) U12.1(OC)
SIGNAL_12: U1.7(MCLKO/RST/P5.4) U13.1(OC)
TOUCH1: R1.1
TOUCH2: R2.1
TOUCH3: R3.1
TOUCH4: R4.1
TOUCH5: R5.1
TOUCH6: R6.1
TOUCH7: R7.1
TOUCH8: R8.1
TOUCH9: R9.1
TOUCH10: R10.1
TOUCH11: R11.1
TOUCH12: R12.1
TUNE: R13.1 U1.1(T2/SS/P1.2)
Net-(BUZZER1-1): BUZZER1.1(+) D1.2 R14.1
Net-(C1-2): C1.2 R1.2 U2.3(TCH)
Net-(C2-2): C2.2 R2.2 U3.3(TCH)
Net-(C3-2): C3.2 R3.2 U4.3(TCH)
Net-(C4-2): C4.2 R4.2 U5.3(TCH)
Net-(C5-2): C5.2 R5.2 U6.3(TCH)
Net-(C6-2): C6.2 R6.2 U7.3(TCH)
Net-(C7-2): C7.2 R7.2 U8.3(TCH)
Net-(C8-2): C8.2 R8.2 U9.3(TCH)
Net-(C9-2): C9.2 R9.2 U10.3(TCH)
Net-(C10-2): C10.2 R10.2 U11.3(TCH)
Net-(C11-2): C11.2 R11.2 U12.3(TCH)
Net-(C12-2): C12.2 R12.2 U13.3(TCH)
Net-(DC1-1): DC1.1 SW1.2
Net-(H1-1): H1.1 U1.12(P3.1/TxD)
Net-(H1-2): H1.2 U1.11(P3.0/RxD/INT4)
Net-(Q1-2): Q1.2(B) R13.2
Net-(Q1-3): Q1.3(C) R14.2

Not connected (* = marked no-connect by the designer): SW1 1 4 5; SW2 4; U1 9(P5.5); U2 4(AHLB) 6(TOG); U3 4(AHLB) 6(TOG); U4 4(AHLB) 6(TOG); U5 4(AHLB) 6(TOG); U6 4(AHLB) 6(TOG); U7 4(AHLB) 6(TOG); U8 4(AHLB) 6(TOG); U9 4(AHLB) 6(TOG); U10 4(AHLB) 6(TOG); U11 4(AHLB) 6(TOG); U12 4(AHLB) 6(TOG); U13 4(AHLB) 6(TOG)

## Notes on the sheet
- 同步模式，输出高电平有效

# Board PCB1
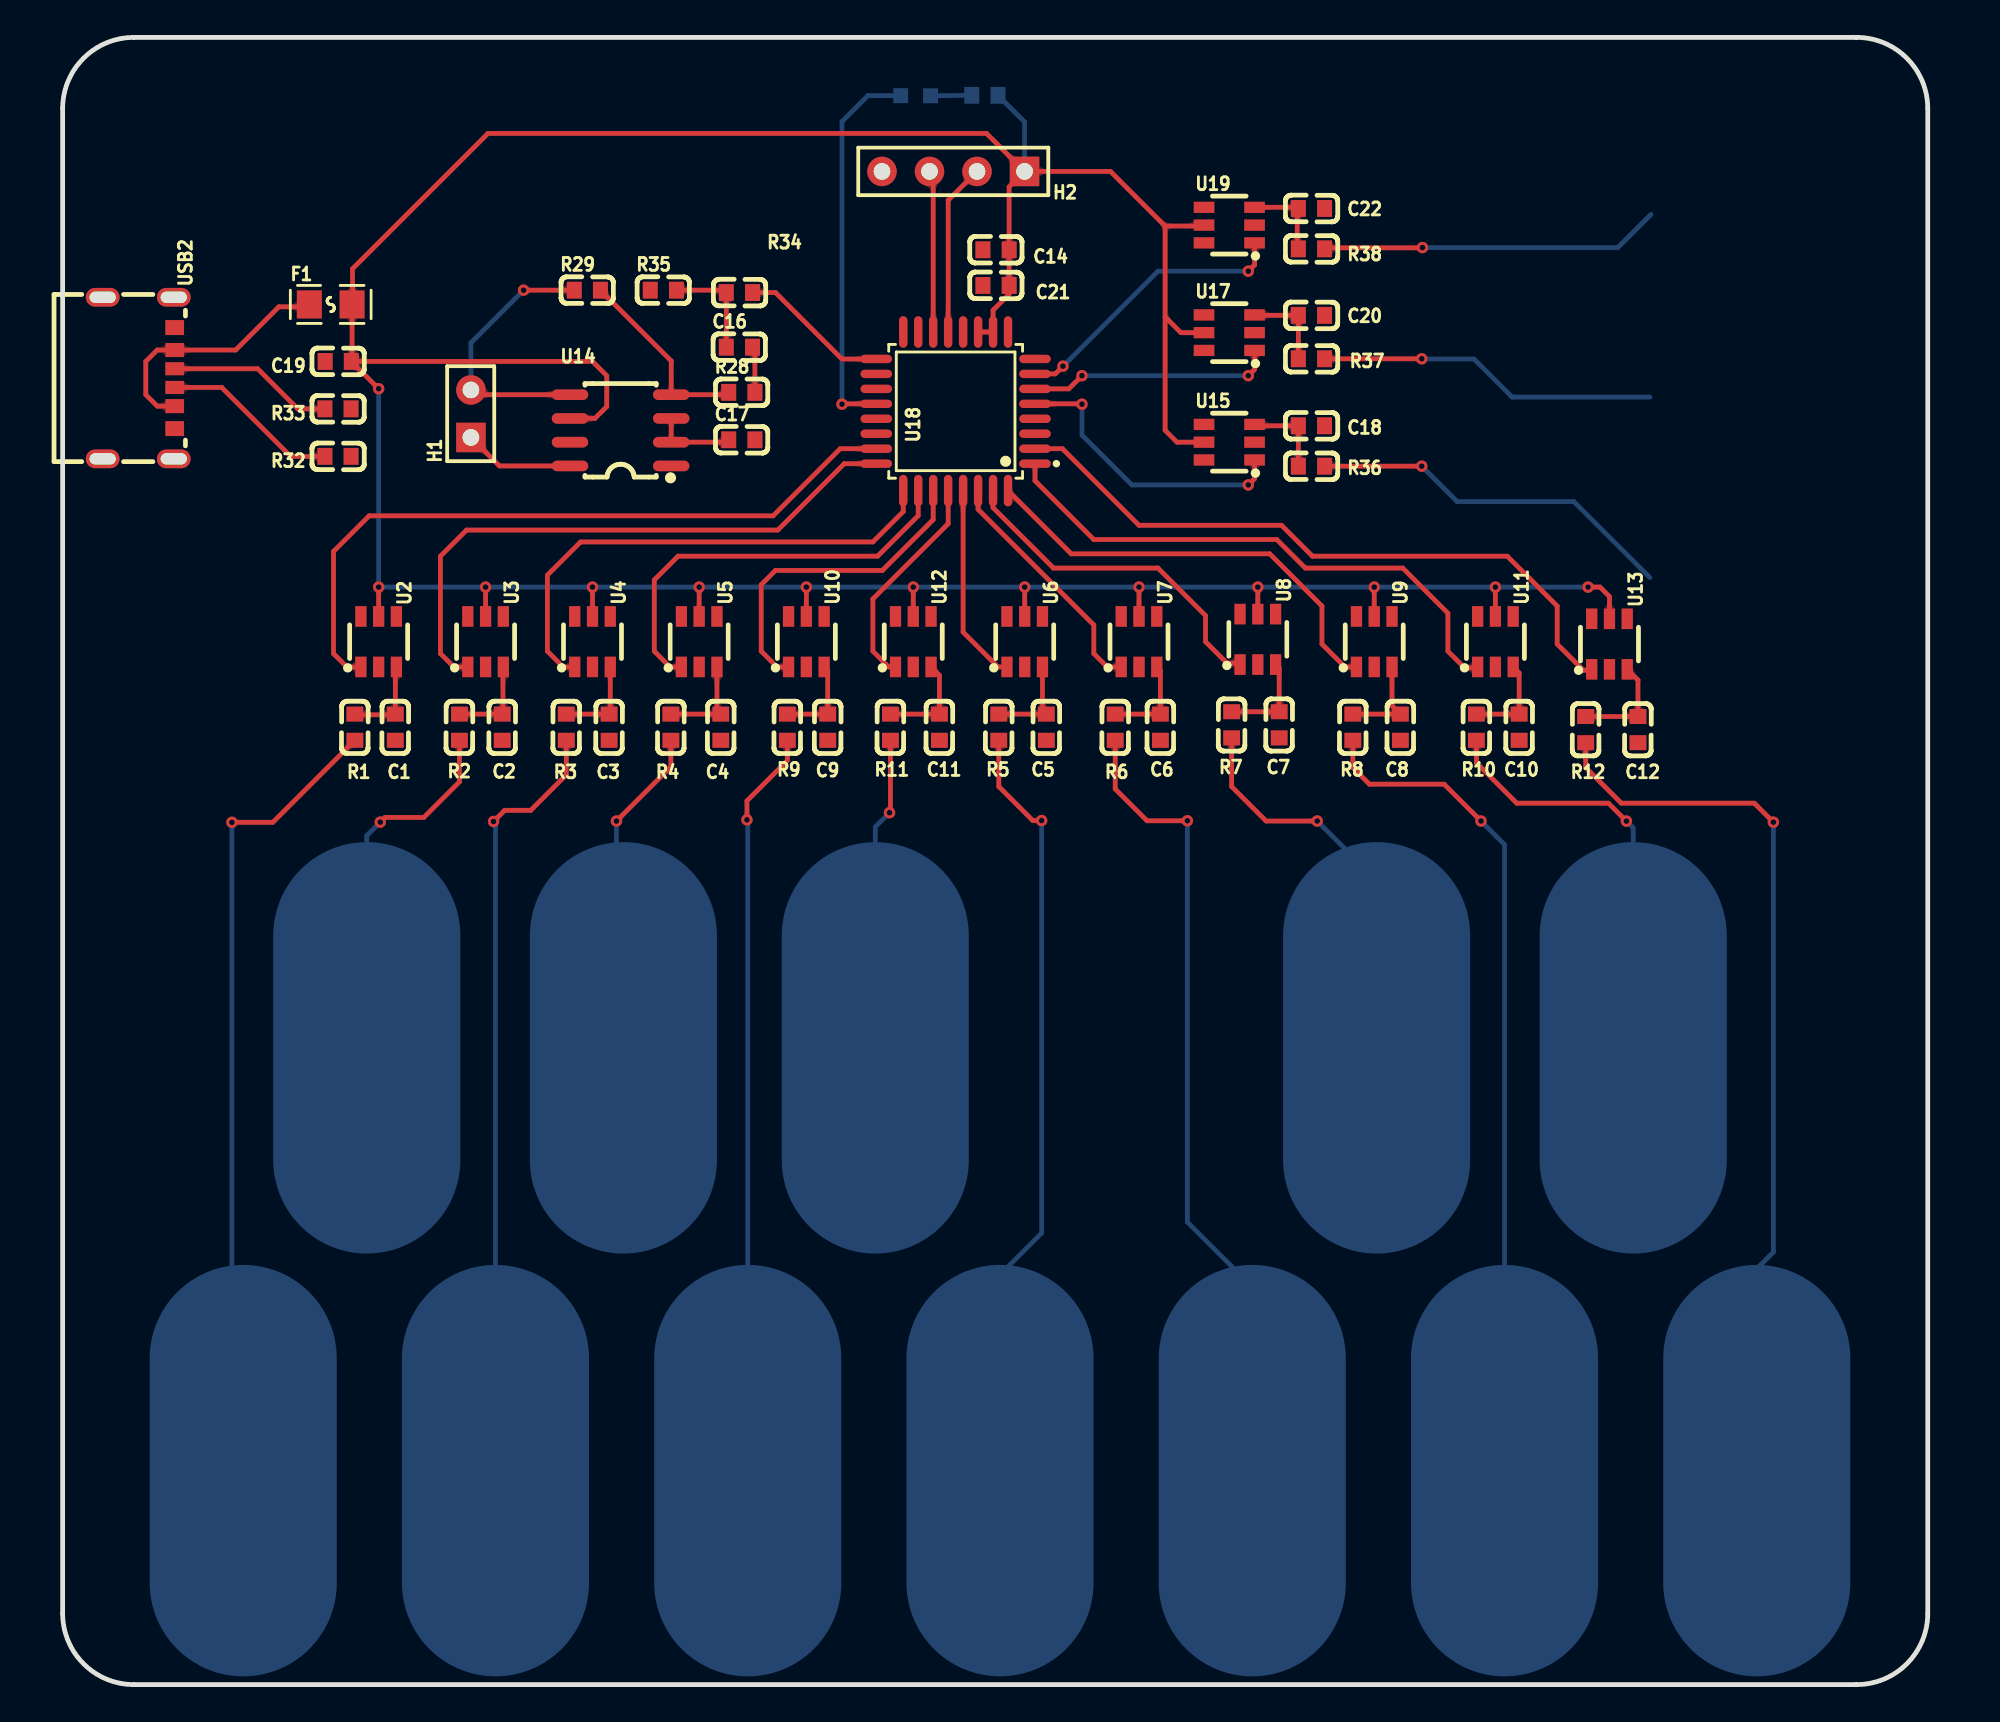
[diagram p3: board, top side]
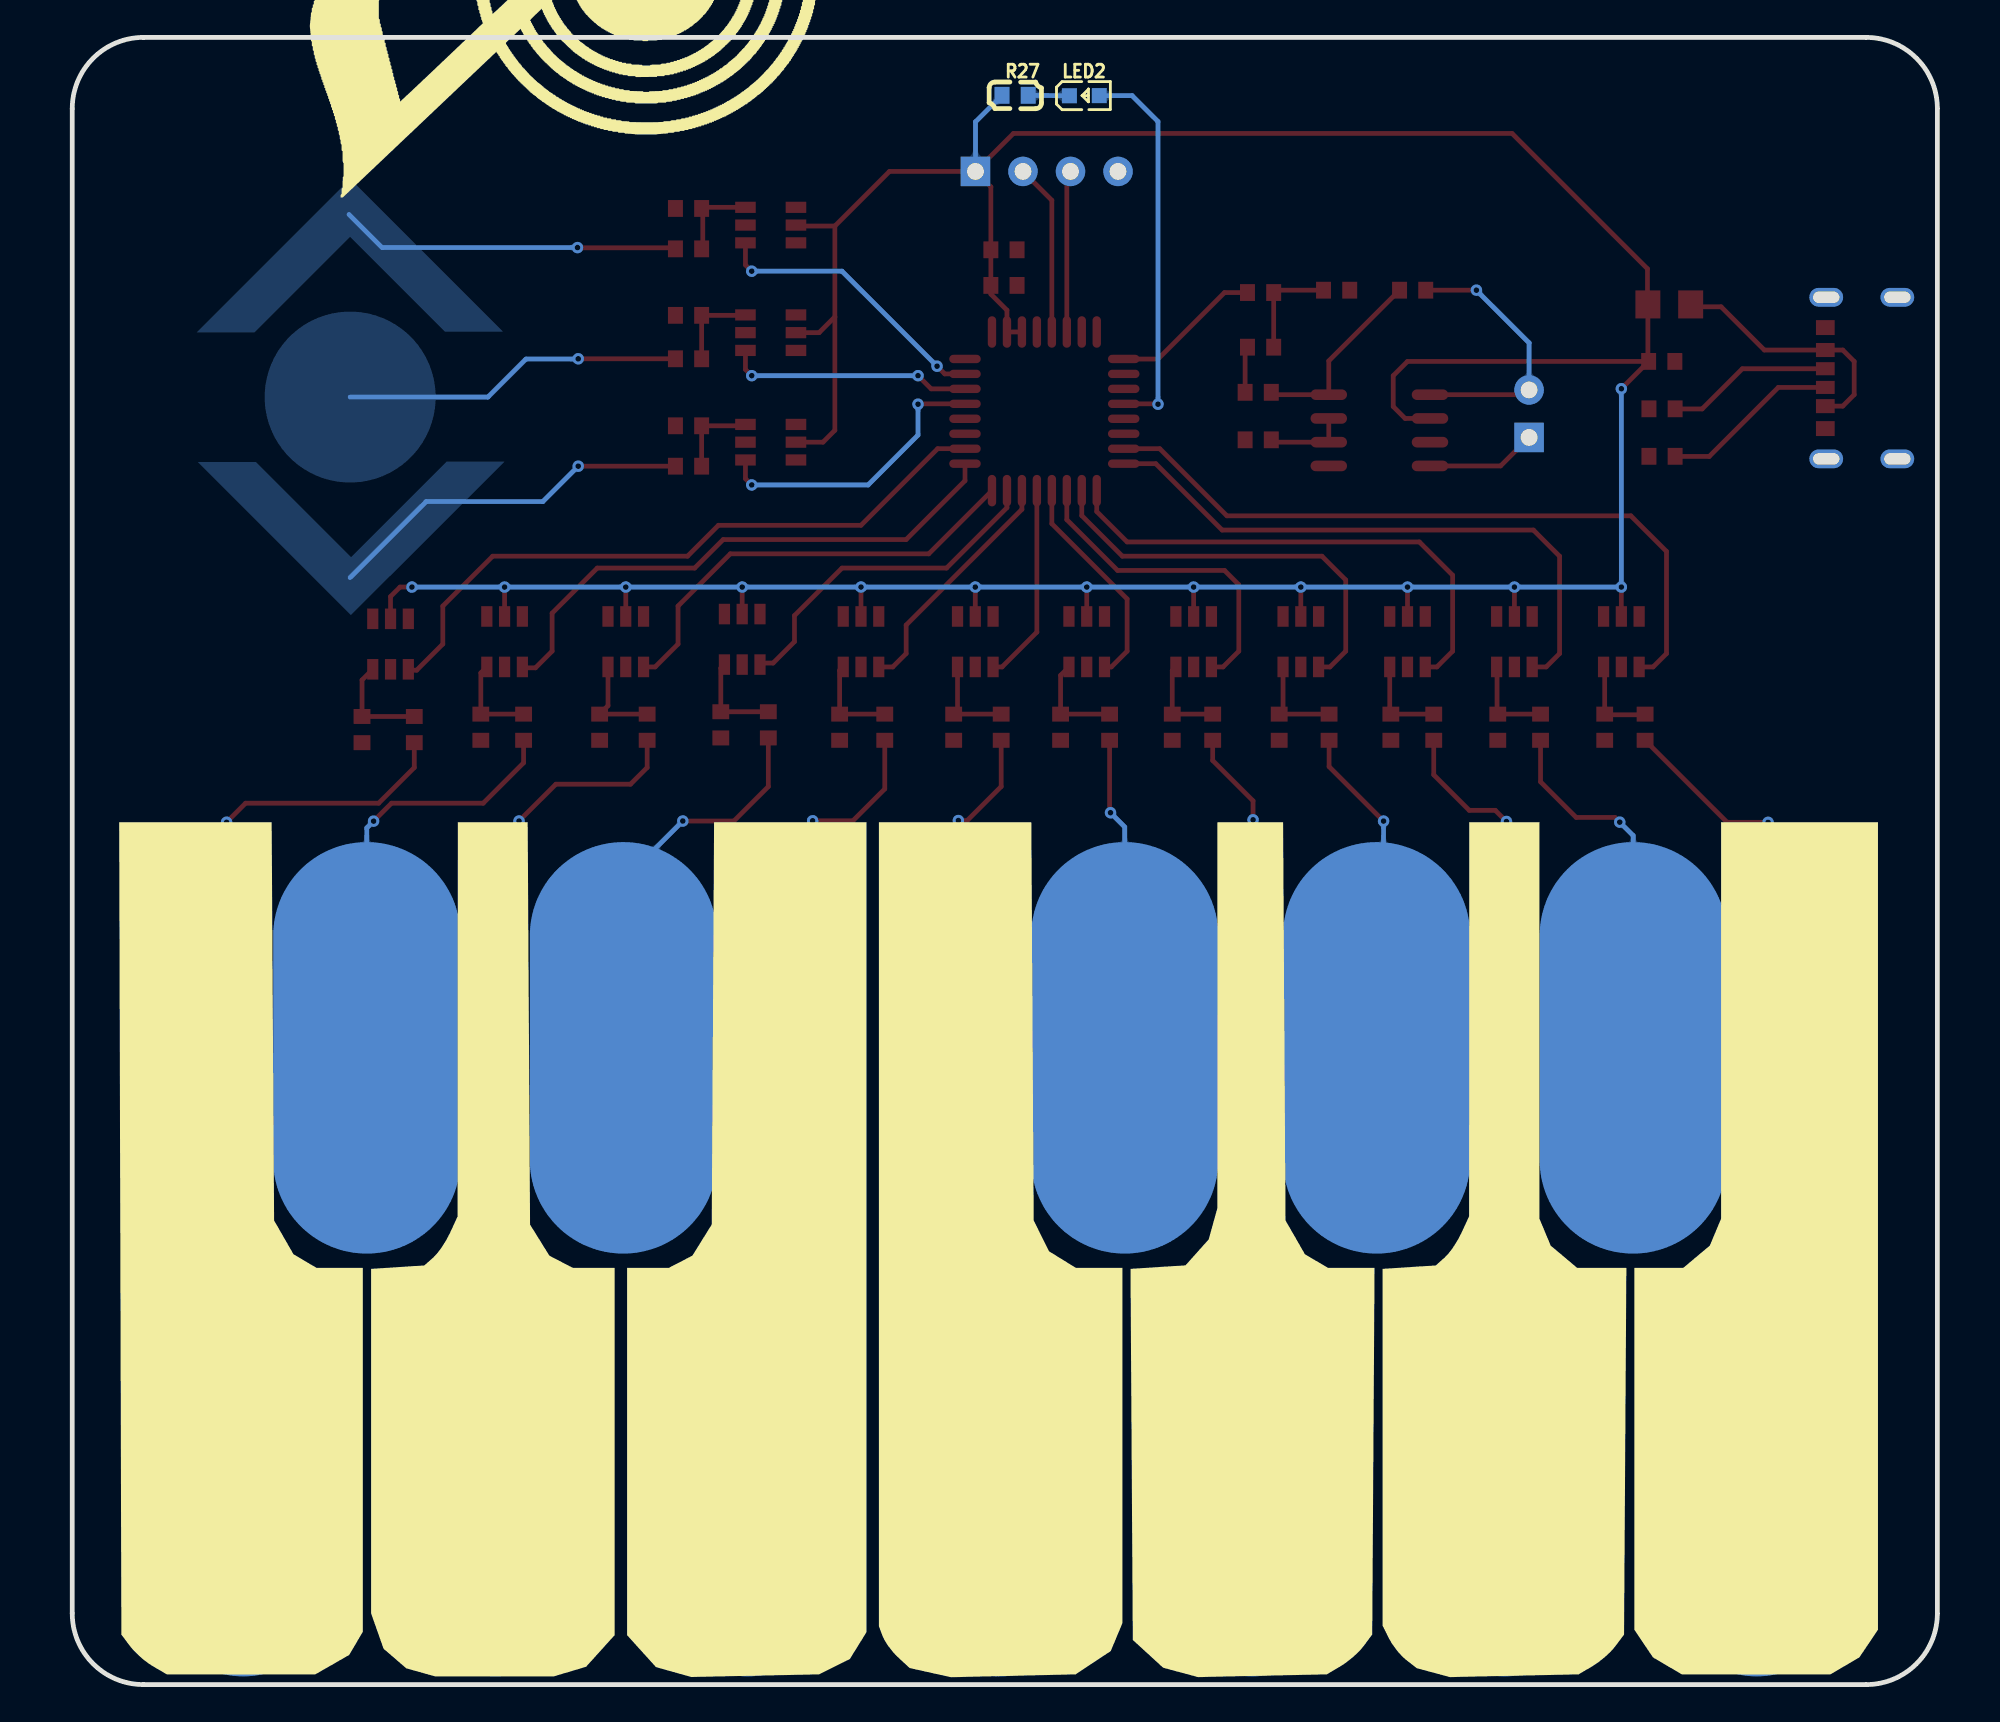
[diagram p4: board, bottom side, seen from below]

Outline 99.69 x 88.08 mm; copper layers: Top Layer, Bottom Layer. Coordinates in mm from the lower left corner of the outline.
Outline path: 0,84.27 0,3.81 arc(1.12,1.12) 3.81,0 95.88,0 arc(98.57,1.12) 99.69,3.81 99.69,84.27 arc(98.57,86.96) 95.88,88.08 3.81,88.08 arc(1.12,86.96) 0,84.27
Stack: Top Layer 0.035mm / Dielectric1 1.51mm FR4 er 4.5 / Bottom Layer 0.035mm

## Design rules (mm)
template: JLCPCB Capability(Two Layers Board)
spacing copperThickness1oz (default): track to track 0.102, other pairs 0.152 to 0.3
spacing copperThickness2oz: track to track 0.203, other pairs 0.152 to 0.3
track width copperThickness1oz (default): min 0.127, default 0.254, max 2.54
track width copperThickness2oz: min 0.203, default 0.254, max 2.54
differential pair differentialPair (default): width min 0.127, default 0.254, max 2.54; gap min 0.152, default 0.152
via viaSize (default): diameter min 0.5, default 0.61, max 10; hole min 0.3, default 0.305, max 6.3

## Placement (name value [footprint] x y rotation side)
C1  20p  [C0603]  17.78 51.19 90 top
C2  20p  [C0603]  23.5 51.19 90 top
C3  20p  [C0603]  29.21 51.19 90 top
C4  20p  [C0603]  35.18 51.19 90 top
C5  20p  [C0603]  52.58 51.19 90 top
C6  20p  [C0603]  58.67 51.19 90 top
C7  20p  [C0603]  65.02 51.32 90 top
C8  20p  [C0603]  71.5 51.19 90 top
C9  20p  [C0603]  40.89 51.19 90 top
C10  20p  [C0603]  77.85 51.19 90 top
C11  20p  [C0603]  46.86 51.19 90 top
C12  20p  [C0603]  84.2 51.07 90 top
C14  0.1u  [C0603]  49.89 76.72 0 top
C16  0.39u  [C0603]  36.17 71.51 0 top
C17  1u  [C0603]  36.3 66.56 0 top
C18  20p  [C0603]  66.75 67.31 180 top
C19  1uF  [C0603]  14.73 70.75 0 top
C20  20p  [C0603]  66.75 73.22 180 top
C21  10uF  [C0603]  49.89 74.81 0 top
C22  20p  [C0603]  66.75 78.93 180 top
F1  ASMD0805-050  [F0805]  14.33 73.8 0 top
H1  HDR-F-2.54_1x2  [HDR-F-2.54_1X2]  21.82 67.96 90 top
H2  HDR-F-2.54_1x4  [HDR-F-2.54_1X4]  47.6 80.91 180 top
J1  HDR-M-2.54_1x1  [TOUCH_PAD]  90.55 11.44 180 bottom
J2  HDR-M-2.54_1x1  [TOUCH_PAD]  83.95 34.05 180 bottom
J3  HDR-M-2.54_1x1  [TOUCH_PAD]  77.07 11.44 180 bottom
J4  HDR-M-2.54_1x1  [TOUCH_PAD]  70.23 34.05 180 bottom
J5  HDR-M-2.54_1x1  [TOUCH_PAD]  63.58 11.44 180 bottom
J6  HDR-M-2.54_1x1  [TOUCH_PAD]  50.1 11.44 180 bottom
J7  HDR-M-2.54_1x1  [TOUCH_PAD]  43.43 34.05 180 bottom
J8  HDR-M-2.54_1x1  [TOUCH_PAD]  36.62 11.44 180 bottom
J9  HDR-M-2.54_1x1  [TOUCH_PAD]  29.97 34.05 180 bottom
J10  HDR-M-2.54_1x1  [TOUCH_PAD]  23.14 11.44 180 bottom
J11  HDR-M-2.54_1x1  [TOUCH_PAD]  16.26 34.05 180 bottom
J12  HDR-M-2.54_1x1  [TOUCH_PAD]  9.65 11.44 180 bottom
LED2  NCD0603R1  [LED0603-RD_RED]  45.59 84.96 180 bottom
R1  1k  [C0603]  15.62 51.19 90 top
R2  1k  [C0603]  21.21 51.19 90 top
R3  1k  [C0603]  26.92 51.19 90 top
R4  1k  [C0603]  32.51 51.19 90 top
R5  1k  [C0603]  50.04 51.19 90 top
R6  1k  [C0603]  56.26 51.19 90 top
R7  1k  [C0603]  62.48 51.32 90 top
R8  1k  [C0603]  68.96 51.19 90 top
R9  1k  [C0603]  38.73 51.19 90 top
R10  1k  [C0603]  75.57 51.19 90 top
R11  1k  [C0603]  44.24 51.19 90 top
R12  1k  [C0603]  81.41 51.07 90 top
R27  1K  [C0603]  49.29 84.98 0 bottom
R28  20k  [C0603]  36.3 69.1 0 top
R29  20k  [C0603]  28.05 74.56 0 top
R32  5.1k  [C0603]  14.72 65.68 180 top
R33  5.1k  [C0603]  14.72 68.22 180 top
R34  1k  [C0603]  36.17 74.43 180 top
R35  1k  [C0603]  32.11 74.56 0 top
R36  1k  [C0603]  66.75 65.15 180 top
R37  1k  [C0603]  66.75 70.89 180 top
R38  1k  [C0603]  66.75 76.77 180 top
U2  RH6015C  [SOT-23-6_L2.9-W1.6-P0.95-LS2.8-BR]  16.89 55.76 270 top
U3  RH6015C  [SOT-23-6_L2.9-W1.6-P0.95-LS2.8-BR]  22.61 55.76 270 top
U4  RH6015C  [SOT-23-6_L2.9-W1.6-P0.95-LS2.8-BR]  28.32 55.76 270 top
U5  RH6015C  [SOT-23-6_L2.9-W1.6-P0.95-LS2.8-BR]  34.02 55.76 270 top
U6  RH6015C  [SOT-23-6_L2.9-W1.6-P0.95-LS2.8-BR]  51.42 55.76 270 top
U7  RH6015C  [SOT-23-6_L2.9-W1.6-P0.95-LS2.8-BR]  57.53 55.76 270 top
U8  RH6015C  [SOT-23-6_L2.9-W1.6-P0.95-LS2.8-BR]  63.88 55.89 270 top
U9  RH6015C  [SOT-23-6_L2.9-W1.6-P0.95-LS2.8-BR]  70.1 55.76 270 top
U10  RH6015C  [SOT-23-6_L2.9-W1.6-P0.95-LS2.8-BR]  39.75 55.76 270 top
U11  RH6015C  [SOT-23-6_L2.9-W1.6-P0.95-LS2.8-BR]  76.58 55.76 270 top
U12  RH6015C  [SOT-23-6_L2.9-W1.6-P0.95-LS2.8-BR]  45.47 55.76 270 top
U13  RH6015C  [SOT-23-6_L2.9-W1.6-P0.95-LS2.8-BR]  82.68 55.64 270 top
U14  TC8002D  [SOIC-8_L5.0-W4.0-P1.27-LS6.0-BL]  29.82 67.07 90 top
U15  RH6015C  [SOT-23-6_L2.9-W1.6-P0.95-LS2.8-BR]  62.36 66.43 0 top
U17  RH6015C  [SOT-23-6_L2.9-W1.6-P0.95-LS2.8-BR]  62.36 72.29 0 top
U18  STC32G12K128-35I-LQFP32  [LQFP-32_L7.0-W7.0-P0.80-LS9.0-BL]  47.73 68.08 90 top
U19  RH6015C  [SOT-23-6_L2.9-W1.6-P0.95-LS2.8-BR]  62.36 78.04 0 top
USB2  TYPE-C 6P(040新)  [USB-C-SMD_TYPE-C-6P]  4.06 69.86 270 top

## Footprints (pads in the part's own frame, mm; a bottom-side part is the same pattern mirrored in y, then rotated)
C0603
  rect 0.8x0.9 smd: 1(-0.7,0) 2(0.7,0)
F0805
  rect 1.335x1.5 smd: 1(-1.143,0) 2(1.143,0)
HDR-F-2.54_1X2
  rect 1.575x1.575 hole 0.889: 1(-1.27,0)
  round 1.575 hole 0.889: 2(1.27,0)
HDR-F-2.54_1X4
  rect 1.575x1.575 hole 0.889: 1(-3.81,0)
  round 1.575 hole 0.889: 2(-1.27,0) 3(1.27,0) 4(3.81,0)
LED0603-RD_RED
  rect 0.8x0.8 smd: 1(-0.799,-0.004) 2(0.799,0.004)
LQFP-32_L7.0-W7.0-P0.80-LS9.0-BL
  oval 0.448x1.684 smd: 1(-2.8,-4.242) 2(-2,-4.242) 3(-1.2,-4.242) 4(-0.4,-4.242) 5(0.4,-4.242) 6(1.2,-4.242) 7(2,-4.242) 8(2.8,-4.242) 17(2.8,4.242) 18(2,4.242) 19(1.2,4.242) 20(0.4,4.242) 21(-0.4,4.242) 22(-1.2,4.242) 23(-2,4.242) 24(-2.8,4.242)
  oval 1.684x0.448 smd: 9(4.242,-2.8) 10(4.242,-2) 11(4.242,-1.2) 12(4.242,-0.4) 13(4.242,0.4) 14(4.242,1.2) 15(4.242,2) 16(4.242,2.8) 25(-4.242,2.8) 26(-4.242,2) 27(-4.242,1.2) 28(-4.242,0.4) 29(-4.242,-0.4) 30(-4.242,-1.2) 31(-4.242,-2) 32(-4.242,-2.8)
SOIC-8_L5.0-W4.0-P1.27-LS6.0-BL
  oval 0.569x1.95 smd: 1(-1.905,-2.705) 2(-0.635,-2.705) 3(0.635,-2.705) 4(1.905,-2.705) 5(1.905,2.705) 6(0.635,2.705) 7(-0.635,2.705) 8(-1.905,2.705)
SOT-23-6_L2.9-W1.6-P0.95-LS2.8-BR
  rect 1.1x0.6 smd: 1(1.35,-0.95) 2(1.35,0) 3(1.35,0.95) 4(-1.35,0.95) 5(-1.35,0) 6(-1.35,-0.95)
TOUCH_PAD
  oval 10x22 smd: 1(0,0)
USB-C-SMD_TYPE-C-6P
  oval 1x1.8 hole 0.6x1.4: 1(-4.32,1.875) 1(-4.32,-1.925) 2(4.32,1.875) 2(4.32,-1.925)
  rect 0.7x1 smd: A5(-0.499,1.925) B5(0.501,1.925)
  rect 0.75x1 smd: A9(1.501,1.925) B9(-1.499,1.925)
  rect 0.8x1 smd: A12(2.701,1.925) B12(-2.699,1.925)

## Nets
As in the schematic, except:
TOUCH1: J12.1 R1.1
TOUCH2: J11.1 R2.1
TOUCH3: J10.1 R3.1
TOUCH4: J9.1 R4.1
TOUCH5: J8.1 R9.1
TOUCH6: J7.1 R11.1
TOUCH7: J6.1 R5.1
TOUCH8: J5.1 R6.1
TOUCH9: J4.1 R7.1
TOUCH10: J3.1 R8.1
TOUCH11: J2.1 R10.1
TOUCH12: J1.1 R12.1

Pads without a net: U2 4 6; U3 4 6; U4 4 6; U5 4 6; U6 4 6; U7 4 6; U8 4 6; U9 4 6; U10 4 6; U11 4 6; U12 4 6; U13 4 6; U15 4 6; U17 4 6; U19 4 6

## Via types
v1: diameter 0.61, hole 0.305, Top Layer to Bottom Layer, 36 vias

## Routing (per net, layer and track width the routed paths; a pad name or vN(x,y) marks a point on that pad's centre or on a via; arc(x,y) is an arc through that point)
VCC: length 200.9
  Top Layer w0.254: 58.93,73.13 59.77,72.29 U17.5 ; 58.93,73.13 58.93,77.99 ; 58.93,73.13 58.93,67.07 59.56,66.43 U15.5 ; U8.5 v1(63.88,58.69) ; C19.2 15.47,70.79 F1.2 15.49,73.82 15.49,75.7 22.73,82.94 49.38,82.94 H2.1 ; C19.2 28.32,70.75 29.08,69.99 29.08,68.34 28.45,67.7 U14.6 ; C19.2 v1(16.89,69.29) ; 58.93,77.99 56.01,80.91 H2.1 ; 58.93,77.99 60.96,77.99 U19.5 ; U10.5 v1(39.75,58.69) ; v1(81.53,58.69) 82.17,58.69 82.68,58.18 U13.5 ; U4.5 v1(28.32,58.69) ; U3.5 v1(22.61,58.69) ; U11.5 v1(76.58,58.69) ; H2.1 50.59,80.09 C14.2 C21.2 50.59,74.35 49.73,73.49 U18.10 U18.11 ; U9.5 v1(70.1,58.69) ; U6.5 v1(51.42,58.69) ; U7.5 v1(57.53,58.69) ; U5.5 v1(34.02,58.69) ; U12.5 v1(45.47,58.69) ; U2.5 v1(16.89,58.69)
  Bottom Layer w0.254: R27.2 51.41,83.56 H2.1 ; v1(16.89,69.29) v1(16.89,58.69) v1(22.61,58.69) v1(28.32,58.69) v1(34.02,58.69) v1(39.75,58.69) v1(45.47,58.69) v1(51.42,58.69) v1(57.53,58.69) v1(63.88,58.69) v1(70.1,58.69) v1(76.58,58.69) v1(81.53,58.69)
KEY0: length 38.5
  Top Layer w0.254: U18.23 41.56,66.08 37.97,62.5 16.38,62.5 14.48,60.59 14.48,55.13 15.19,54.41 U2.1
KEY1: length 32.3
  Top Layer w0.254: U3.1 20.91,54.41 20.19,55.13 20.19,60.34 21.59,61.73 38.23,61.73 41.78,65.28 U18.24
KEY2: length 27.4
  Top Layer w0.254: U4.1 26.75,54.41 25.91,55.26 25.91,59.32 27.69,61.1 43.31,61.1 44.93,62.72 44.93,63.84
KEY3: length 22.5
  Top Layer w0.254: 33.07,54.41 32.47,54.41 31.62,55.26 31.62,59.07 32.89,60.34 43.56,60.34 45.73,62.51 45.73,63.84
KEY4: length 17.6
  Top Layer w0.254: 46.53,63.84 46.53,62.29 43.82,59.57 38.1,59.57 37.34,58.81 37.34,55.26 38.18,54.41 U10.1
KEY5: length 11.8
  Top Layer w0.254: U12.1 44.15,54.41 43.31,55.26 43.31,58.05 47.33,62.07 47.33,63.84
KEY6: length 10.7
  Top Layer w0.254: U6.1 49.99,54.41 48.13,56.28 48.13,63.84
KEY7: length 13
  Top Layer w0.254: 48.93,63.84 48.93,62.84 55.12,56.65 55.12,55.13 55.83,54.41 U7.1
KEY8: length 18.4
  Top Layer w0.254: U8.1 62.85,54.62 62.23,54.62 61.09,55.76 61.09,57.16 58.55,59.7 52.96,59.7 49.73,62.93 49.73,63.84
KEY9: length 23.7
  Top Layer w0.254: U9.1 68.53,54.41 67.31,55.64 67.31,57.67 64.52,60.46 53.91,60.46 50.53,63.84
KEY10: length 29.9
  Top Layer w0.254: U11.1 75.58,54.37 74.93,54.37 74.04,55.26 74.04,57.29 71.63,59.7 66.42,59.7 64.9,61.23 55.12,61.23 51.97,64.37 U18.1
KEY11: length 35.9
  Top Layer w0.254: U18.2 53.44,66.08 57.53,61.99 65.15,61.99 66.8,60.34 77.22,60.34 79.88,57.67 79.88,55.64 81.28,54.24 81.68,54.24 U13.1
LED: length 20.7
  Top Layer w0.254: U18.20 41.67,68.48 v1(41.66,68.46)
  Bottom Layer w0.254: LED2.2 43.04,84.96 41.66,83.58 v1(41.66,68.46)
RXD: length 9.2
  Top Layer w0.254: U18.13 47.33,79.37 H2.2
SOUND: length 8.1
  Top Layer w0.254: R34.1 38.1,74.43 41.66,70.88 43.48,70.88 U18.17
SWITCH1: length 15.3
  Top Layer w0.254: U18.7 53.05,70.08 v1(53.47,70.5) ; v1(63.37,75.58) 63.71,75.91 U19.1
  Bottom Layer w0.254: v1(63.37,75.58) 58.55,75.58 v1(53.47,70.5)
SWITCH2: length 13.2
  Top Layer w0.254: U18.6 53.78,69.28 v1(54.48,69.99) ; v1(63.37,69.99) 63.71,70.32 U17.1
  Bottom Layer w0.254: v1(54.48,69.99) v1(63.37,69.99)
SWITCH3: length 15.6
  Top Layer w0.254: v1(54.48,68.46) 54.46,68.48 U18.5 ; v1(63.37,64.15) 63.71,64.48 U15.1
  Bottom Layer w0.254: v1(54.48,68.46) 54.48,66.81 57.15,64.15 v1(63.37,64.15)
TOUCH1: length 43.3
  Top Layer w0.254: R1.1 11.23,46.11 v1(9.05,46.11)
  Bottom Layer w0.254: v1(9.05,46.11) 9.05,20.68 9.65,20.08 J12.1
TOUCH2: length 19.7
  Top Layer w0.254: R2.1 21.21,48.27 19.3,46.37 17.23,46.37 v1(16.98,46.12)
  Bottom Layer w0.254: J11.1 16.26,45.39 16.98,46.12
TOUCH3: length 41.5
  Top Layer w0.254: v1(23.03,46.15) 23.63,46.75 25.02,46.75 26.92,48.65 R3.1
  Bottom Layer w0.254: v1(23.03,46.15) 23.13,46.05 23.13,11.44
TOUCH4: length 17.8
  Top Layer w0.254: R4.1 32.51,49.08 v1(29.6,46.17)
  Bottom Layer w0.254: 29.6,46.17 29.6,34.42 J9.1
TOUCH5: length 40
  Top Layer w0.254: R9.1 38.73,49.41 36.58,47.26 v1(36.58,46.24)
  Bottom Layer w0.254: v1(36.58,46.24) 36.62,46.2 36.62,11.44
TOUCH6: length 16.8
  Top Layer w0.254: v1(44.2,46.62) 44.24,46.67 R11.1
  Bottom Layer w0.254: v1(44.2,46.62) 43.43,45.86 J7.1
TOUCH7: length 41.2
  Top Layer w0.254: R5.1 50.04,48.02 51.85,46.2 v1(52.33,46.2)
  Bottom Layer w0.254: v1(52.33,46.2) 52.33,24.14 50.1,21.92 J6.1
TOUCH8: length 43.3
  Top Layer w0.254: R6.1 56.26,47.89 57.96,46.19 v1(60.12,46.19)
  Bottom Layer w0.254: v1(60.12,46.19) 60.12,24.73 63.58,21.26 J5.1
TOUCH9: length 21.4
  Top Layer w0.254: v1(67.06,46.18) 64.33,46.18 62.48,48.02 R7.1
  Bottom Layer w0.254: J4.1 70.23,43 v1(67.06,46.18)
TOUCH10: length 44.7
  Top Layer w0.254: R8.1 68.96,49.03 69.85,48.14 73.84,48.14 v1(75.81,46.18)
  Bottom Layer w0.254: J3.1 77.07,44.92 75.81,46.18
TOUCH11: length 22.8
  Top Layer w0.254: v1(83.58,46.17) 82.63,47.13 77.72,47.13 75.57,49.29 R10.1
  Bottom Layer w0.254: v1(83.58,46.17) 83.95,45.81 J2.1
TOUCH12: length 47.6
  Top Layer w0.254: v1(91.44,46.11) 90.42,47.13 83.31,47.13 81.41,49.03 R12.1
  Bottom Layer w0.254: J1.1 90.55,22.24 91.44,23.13 v1(91.44,46.11)
TOUCH13: length 19.9
  Top Layer w0.254: R36.1 v1(72.64,65.15)
  Bottom Layer w0.254: v1(72.64,65.15) 74.54,63.26 80.77,63.26 84.84,59.19
TOUCH14: length 18.2
  Top Layer w0.254: R37.1 v1(72.64,70.89)
  Bottom Layer w0.254: v1(72.64,70.89) 72.66,70.88 75.44,70.88 77.47,68.85 84.84,68.85
TOUCH15: length 18.2
  Top Layer w0.254: 67.39,76.83 72.67,76.83 v1(72.68,76.84)
  Bottom Layer w0.254: 84.9,78.61 83.12,76.84 v1(72.68,76.84)
TXD: length 8.7
  Top Layer w0.254: U18.14 46.53,80.71 H2.3
$1N1124: length 4.5
  Top Layer w0.254: 17.79,51.88 17.77,51.86 15.71,51.86 ; 17.78,54.3 17.78,51.9
$1N1133: length 4.8
  Top Layer w0.254: R2.2 C2.2 ; 23.53,54.41 23.53,51.92 23.5,51.88
$1N1138: length 4.8
  Top Layer w0.254: R3.2 C3.2 29.27,51.95 U4.3
$1N1145: length 5.3
  Top Layer w0.254: U5.3 34.97,52.1 C4.2 R4.2
$1N1152: length 5.1
  Top Layer w0.254: U6.3 52.37,52.1 C5.2 R5.2
$1N1159: length 5
  Top Layer w0.254: R6.2 C6.2 58.67,54.22 U7.3
$1N1166: length 5.1
  Top Layer w0.254: U8.3 65.02,54.35 C7.2 R7.2
$1N1173: length 5.2
  Top Layer w0.254: U9.3 71.05,52.34 C8.2 R8.2
$1N1180: length 4.8
  Top Layer w0.254: R9.2 C9.2 40.89,54.22 U10.3
$1N1187: length 4.9
  Top Layer w0.254: R10.2 C10.2 77.85,54.09 U11.3
$1N1448: length 5.3
  Top Layer w0.254: U12.3 46.86,53.97 C11.2 R11.2
$1N1455: length 5.6
  Top Layer w0.254: U13.3 84.2,53.71 C12.2 R12.2
$1N1642: length 8.9
  Top Layer w0.254: R33.2 14.01,68.21 12.57,68.21 10.42,70.36 USB2.A5
$1N1644: length 13.6
  Top Layer w0.254: F1.1 13.06,73.67 11.56,73.67 9.25,71.36 USB2.B9 5.06,71.36 4.45,70.75 4.45,68.97 5.06,68.36 USB2.A9
$1N1645: length 9.6
  Top Layer w0.254: USB2.B5 8.5,69.36 12.19,65.67 14.01,65.67 R32.2
$1N1710: length 2.2
  Bottom Layer w0.254: LED2.1 R27.1
$1N2160: length 14.6
  Top Layer w0.254: H1.2 22.08,68.97 U14.5 ; v1(24.64,74.56) R29.1
  Bottom Layer w0.254: H1.2 21.82,71.75 v1(24.64,74.56)
$1N2161: length 10.3
  Top Layer w0.254: R28.1 35.47,68.97 U14.4 32.53,70.78 R29.2
$1N2162: length 5.9
  Top Layer w0.254: H1.1 23.35,65.16 U14.8
$1N2164: length 4.4
  Top Layer w0.254: C17.1 35.47,66.43 U14.2 U14.3
$1N2169: length 5.6
  Top Layer w0.254: R35.2 35.35,74.56 R34.2 C16.1
$1N2171: length 2.5
  Top Layer w0.254: R28.2 37,71.39 C16.2
$1N8905: length 4.5
  Top Layer w0.254: U15.3 63.78,67.31 C18.2 R36.2
$1N12216: length 4.7
  Top Layer w0.254: R37.2 C20.2 63.73,73.22 U17.3
$1N14986: length 4.6
  Top Layer w0.254: 65.99,78.99 C22.2 ; 65.99,78.99 65.99,76.83 R38.2 ; 65.99,78.99 U19.3

## Copper pours and planes (outline as drawn; the poured copper is in the pictures)
GND on Top Layer: 74.93,88.28 0.59,88.28 0.59,47.89 86.87,47.89 87.5,48.53 87.5,54.62 86.1,56.02 78.74,56.02 74.93,59.83
GND on Bottom Layer: 0.59,88.28 0.59,47.89 86.87,47.89 87.5,48.53 87.5,54.62 86.1,56.02 78.74,56.02 74.93,59.83 74.93,88.28
TOUCH13 on Bottom Layer: 76.59,65.39 92.98,65.39 92.98,57.19 76.59,57.19
TOUCH14 on Bottom Layer: 80.27,73.41 89.4,73.41 89.4,64.28 80.27,64.28
TOUCH15 on Bottom Layer: 76.66,80.51 93.04,80.51 93.04,72.3 76.66,72.3

Small or netless copper shapes (teardrops, artwork), in the pictures only: 200 on Top Layer, 64 on Bottom Layer

# Board PCB_ePiano_2023-12-26
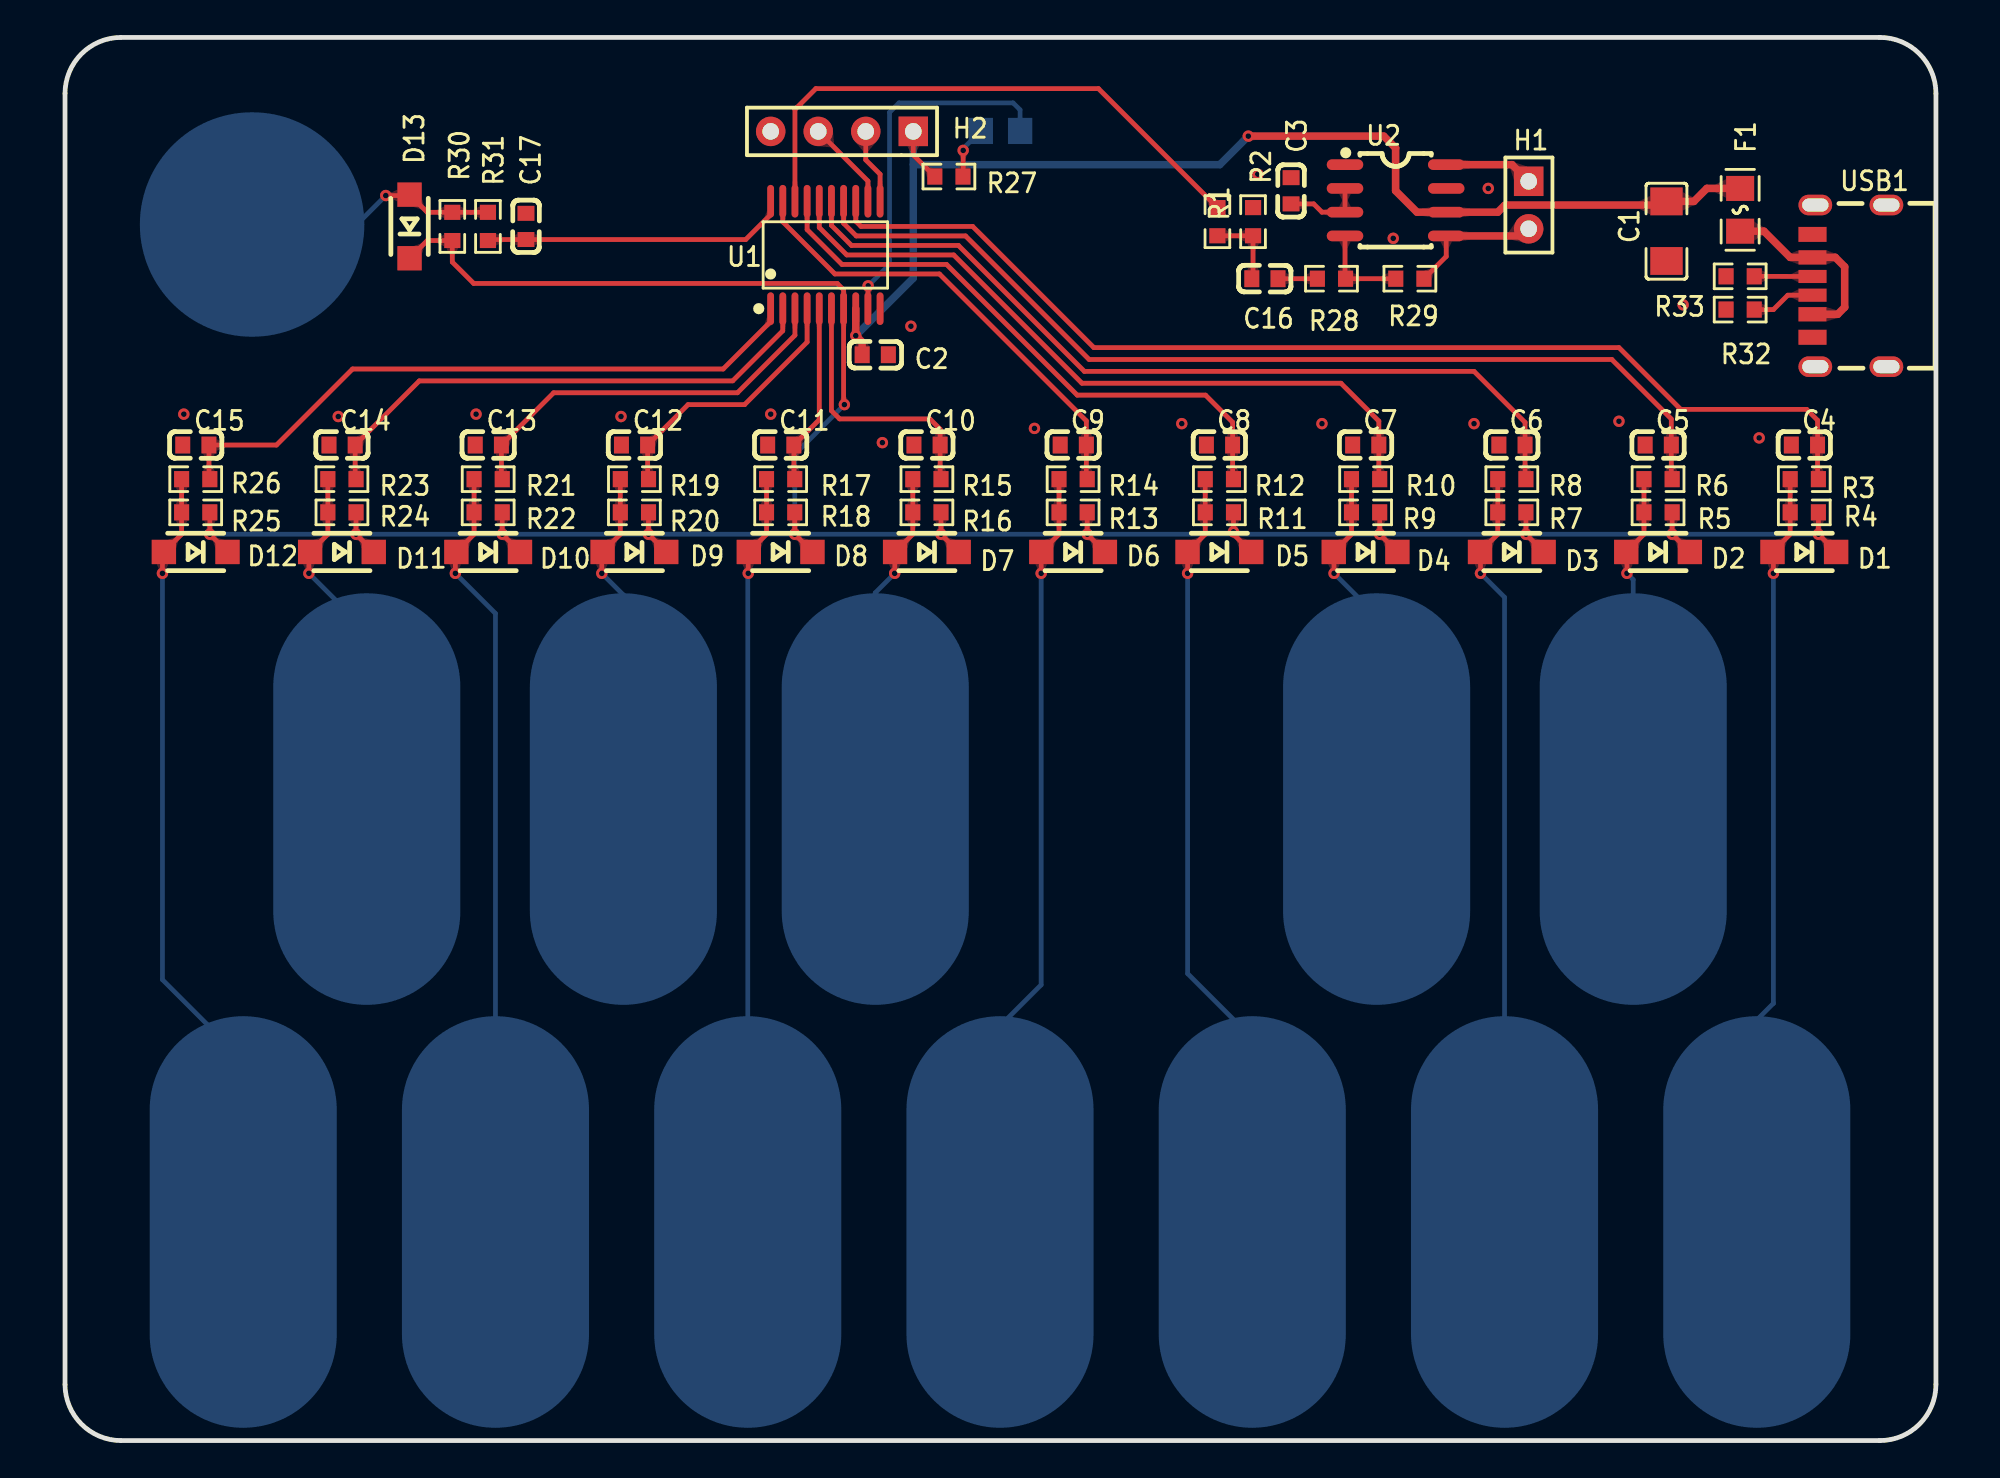
[diagram p5: board, top side]
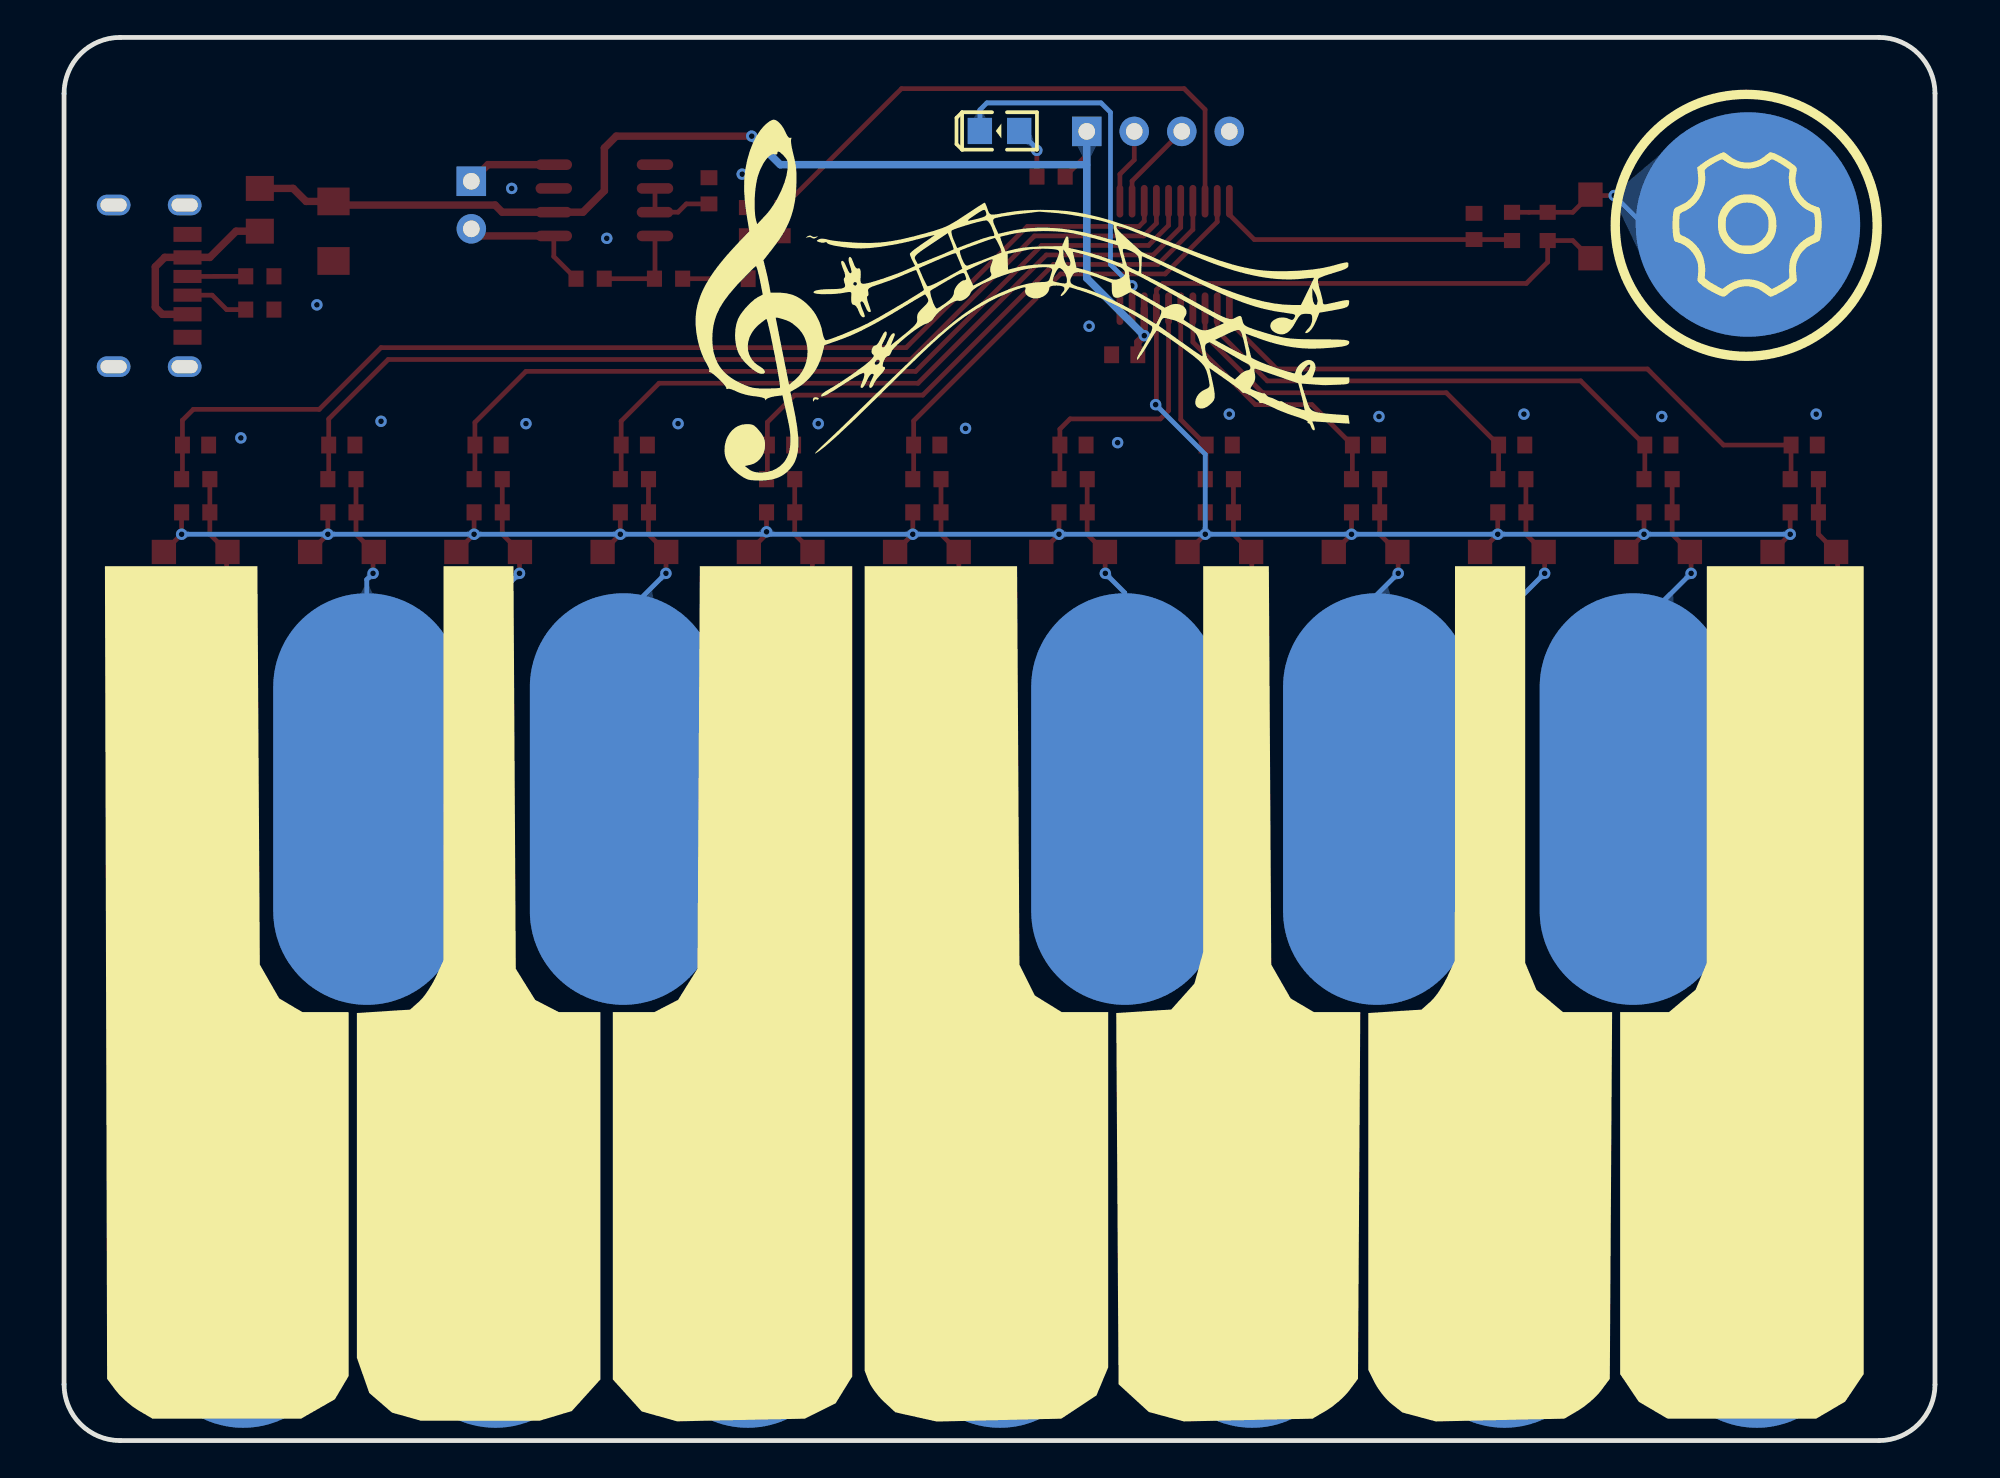
[diagram p6: board, bottom side, seen from below]

Outline 100 x 75 mm; copper layers: Top Layer, Bottom Layer. Coordinates in mm from the lower left corner of the outline.
Outline path: 0,72 arc(0.88,74.12) 3,75 97,75 arc(99.12,74.12) 100,72 100,3 arc(99.12,0.88) 97,0 3,0 arc(0.88,0.88) 0,3 0,72
Stack: Top Layer 0.035mm / Dielectric1 1.51mm FR4 er 4.5 / Bottom Layer 0.035mm

## Design rules (mm)
spacing Default (default): track to track 0.152, other pairs 0 to 0.152
track width Default (default): min 0.254, default 0.254, max 25.4
differential pair differentialPair (default): width min 0.127, default 0.254, max 2.54; gap min 0.152, default 0.152
via Default (default): diameter min 0.61, default 0.61, max 100.025; hole min 0.305, default 0.305, max 59.995
net GND uses gge10596
pour e480 uses gge10476
pour e583 uses gge10596

## Placement (name value [footprint] x y rotation side)
C1  10u  [C1206]  85.6 64.64 90 top
C2  0.1u  [C0603]  43.31 58.04 180 top
C3  1u  [C0603]  65.53 66.8 90 top
C4  10nF  [C0603]  92.97 53.21 0 top
C5  10nF  [C0603]  85.16 53.21 0 top
C6  10nF  [C0603]  77.34 53.21 0 top
C7  10nF  [C0603]  69.52 53.21 0 top
C8  10nF  [C0603]  61.71 53.21 0 top
C9  10nF  [C0603]  53.89 53.21 0 top
C10  10nF  [C0603]  46.07 53.21 0 top
C11  10nF  [C0603]  38.26 53.21 0 top
C12  10nF  [C0603]  30.44 53.21 0 top
C13  10nF  [C0603]  22.62 53.21 0 top
C14  10nF  [C0603]  14.81 53.21 0 top
C15  10nF  [C0603]  6.99 53.21 0 top
C16  0.39u  [C0603]  64.13 62.1 0 top
C17  10nF  [C0603]  24.64 64.9 270 top
D1  1N4148W  [SOD-123FL_L2.6-W1.6-LS3.4-RD]  92.96 47.5 0 top
D2  1N4148W  [SOD-123FL_L2.6-W1.6-LS3.4-RD]  85.15 47.5 0 top
D3  1N4148W  [SOD-123FL_L2.6-W1.6-LS3.4-RD]  77.33 47.5 0 top
D4  1N4148W  [SOD-123FL_L2.6-W1.6-LS3.4-RD]  69.51 47.5 0 top
D5  1N4148W  [SOD-123FL_L2.6-W1.6-LS3.4-RD]  61.7 47.5 0 top
D6  1N4148W  [SOD-123FL_L2.6-W1.6-LS3.4-RD]  53.88 47.5 0 top
D7  1N4148W  [SOD-123FL_L2.6-W1.6-LS3.4-RD]  46.07 47.5 0 top
D8  1N4148W  [SOD-123FL_L2.6-W1.6-LS3.4-RD]  38.25 47.5 0 top
D9  1N4148W  [SOD-123FL_L2.6-W1.6-LS3.4-RD]  30.43 47.5 0 top
D10  1N4148W  [SOD-123FL_L2.6-W1.6-LS3.4-RD]  22.62 47.5 0 top
D11  1N4148W  [SOD-123FL_L2.6-W1.6-LS3.4-RD]  14.8 47.5 0 top
D12  1N4148W  [SOD-123FL_L2.6-W1.6-LS3.4-RD]  6.98 47.5 0 top
D13  1N4148W  [SOD-123FL_L2.6-W1.6-LS3.4-RD]  18.42 64.9 270 top
F1  ASMD0805-050  [F0805]  89.53 65.79 90 top
H1  HDR-F-2.54_1x2  [HDR-F-2.54_1X2]  78.23 66.04 270 top
H2  HDR-F-2.54_1x4  [HDR-F-2.54_1X4]  41.53 69.98 180 top
J1  HDR-M-2.54_1x1  [TOUCH_PAD]  90.42 11.68 180 bottom
J2  HDR-M-2.54_1x1  [TOUCH_PAD]  83.82 34.29 180 bottom
J3  HDR-M-2.54_1x1  [TOUCH_PAD]  76.94 11.68 180 bottom
J4  HDR-M-2.54_1x1  [TOUCH_PAD]  70.1 34.29 180 bottom
J5  HDR-M-2.54_1x1  [TOUCH_PAD]  63.46 11.68 180 bottom
J6  HDR-M-2.54_1x1  [TOUCH_PAD]  49.97 11.68 180 bottom
J7  HDR-M-2.54_1x1  [TOUCH_PAD]  43.31 34.29 180 bottom
J8  HDR-M-2.54_1x1  [TOUCH_PAD]  36.49 11.68 180 bottom
J9  HDR-M-2.54_1x1  [TOUCH_PAD]  29.84 34.29 180 bottom
J10  HDR-M-2.54_1x1  [TOUCH_PAD]  23.01 11.68 180 bottom
J11  HDR-M-2.54_1x1  [TOUCH_PAD]  16.13 34.29 180 bottom
J12  HDR-M-2.54_1x1  [TOUCH_PAD]  9.53 11.68 180 bottom
J13  HDR-M-2.54_1x1  [TOUCH_PAD#2]  10 65 180 bottom
LED2  LED-0805_R  [LED0805_RED]  50 70 0 bottom
R1  1k  [R0603]  61.59 65.15 270 top
R2  1k  [R0603]  63.5 65.15 270 top
R3  1M  [R0603]  92.96 51.39 0 top
R4  1M  [R0603]  92.96 49.61 180 top
R5  1M  [R0603]  85.15 49.61 180 top
R6  1M  [R0603]  85.15 51.39 0 top
R7  1M  [R0603]  77.33 49.61 180 top
R8  1M  [R0603]  77.33 51.39 0 top
R9  1M  [R0603]  69.51 49.61 180 top
R10  1M  [R0603]  69.51 51.39 0 top
R11  1M  [R0603]  61.7 49.61 180 top
R12  1M  [R0603]  61.7 51.39 0 top
R13  1M  [R0603]  53.88 49.61 180 top
R14  1M  [R0603]  53.88 51.39 0 top
R15  1M  [R0603]  46.07 51.39 0 top
R16  1M  [R0603]  46.07 49.61 180 top
R17  1M  [R0603]  38.25 51.39 0 top
R18  1M  [R0603]  38.25 49.61 180 top
R19  1M  [R0603]  30.43 51.39 0 top
R20  1M  [R0603]  30.43 49.61 180 top
R21  1M  [R0603]  22.62 51.39 0 top
R22  1M  [R0603]  22.62 49.61 180 top
R23  1M  [R0603]  14.8 51.39 0 top
R24  1M  [R0603]  14.8 49.61 180 top
R25  1M  [R0603]  6.98 49.61 180 top
R26  1M  [R0603]  6.98 51.39 0 top
R27  1K  [R0603]  47.24 67.56 180 top
R28  20k  [R0603]  67.69 62.1 180 top
R29  20k  [R0603]  71.88 62.1 180 top
R30  1M  [R0603]  20.7 64.9 90 top
R31  1M  [R0603]  22.61 64.9 270 top
R32  5.1k  [R0603]  89.53 60.45 0 top
R33  5.1k  [R0603]  89.53 62.23 0 top
U1  STC8G1K17-38I-TSSOP20  [TSSOP-20_L6.5-W4.4-P0.65-LS6.4-BL]  40.64 63.37 0 top
U2  TC8002D  [SOIC-8_L5.0-W4.0-P1.27-LS6.0-BL]  71.12 66.29 270 top
USB1  TYPE-C-31-M-17  [USB-C-SMD_10P-P1.00-L6.8-W8.9]  95.38 61.72 90 top

## Footprints (pads in the part's own frame, mm; a bottom-side part is the same pattern mirrored in y, then rotated)
C0603
  rect 0.8x0.9 smd: 1(-0.7,0) 2(0.7,0)
C1206
  rect 1.485x1.728 smd: 1(-1.593,0) 2(1.593,0)
F0805
  rect 1.335x1.5 smd: 1(-1.143,0) 2(1.143,0)
HDR-F-2.54_1X2
  rect 1.575x1.575 hole 0.889: 1(-1.27,0)
  round 1.575 hole 0.889: 2(1.27,0)
HDR-F-2.54_1X4
  rect 1.575x1.575 hole 0.889: 1(-3.81,0)
  round 1.575 hole 0.889: 2(-1.27,0) 3(1.27,0) 4(3.81,0)
LED0805_RED
  rect 1.3x1.399 smd: 1(-1.05,0) 2(1.05,0)
R0603
  rect 0.806x0.864 smd: 1(-0.753,0) 2(0.753,0)
SOD-123FL_L2.6-W1.6-LS3.4-RD
  rect 1.3x1.3 smd: 1(1.7,0) 2(-1.7,0)
SOIC-8_L5.0-W4.0-P1.27-LS6.0-BL
  oval 0.569x1.95 smd: 1(-1.905,-2.705) 2(-0.635,-2.705) 3(0.635,-2.705) 4(1.905,-2.705) 5(1.905,2.705) 6(0.635,2.705) 7(-0.635,2.705) 8(-1.905,2.705)
TOUCH_PAD
  oval 10x22 smd: 1(0,0)
TOUCH_PAD#2
  round 12 smd: 1(0,0)
TSSOP-20_L6.5-W4.4-P0.65-LS6.4-BL
  oval 0.364x1.742 smd: 1(-2.925,-2.871) 2(-2.275,-2.871) 3(-1.625,-2.871) 4(-0.975,-2.871) 5(-0.325,-2.871) 6(0.325,-2.871) 7(0.975,-2.871) 8(1.625,-2.871) 9(2.275,-2.871) 10(2.925,-2.871) 11(2.925,2.871) 12(2.275,2.871) 13(1.625,2.871) 14(0.975,2.871) 15(0.325,2.871) 16(-0.325,2.871) 17(-0.975,2.871) 18(-1.625,2.871) 19(-2.275,2.871) 20(-2.925,2.871)
USB-C-SMD_10P-P1.00-L6.8-W8.9
  oval 1.1x1.8 hole 0.7x1.401: 0(4.32,1.825) 7(-4.32,1.825) 8(4.32,-1.975) 9(-4.32,-1.975)
  rect 0.8x1.5 smd: 1(-2.749,1.975) 6(2.749,1.975)
  rect 0.76x1.5 smd: 2(-1.52,1.975) 5(1.52,1.975)
  rect 0.7x1.5 smd: 3(-0.5,1.975) 4(0.5,1.975)

## Nets
GND: C1.1 C2.1 C3.2 C4.1 C5.1 C6.1 C7.1 C8.1 C9.1 C10.1 C11.1 C12.1 C13.1 C14.1 C15.1 C17.1 H2.4 R2.1 R32.1 R33.1 U1.10 U2.1 U2.7 USB1.0 USB1.1 USB1.6 USB1.7 USB1.8 USB1.9
VCC: C1.2 C2.2 F1.2 H2.1 R27.2 U1.8 U2.6
C3_1: C3.1 U2.2 U2.3
F1_1: F1.1 USB1.2 USB1.5
H1_1: H1.1 U2.8
H1_2: H1.2 R29.1 U2.5
J1_1: D1.2 J1.1 R3.1 R4.2
J7_1: D7.2 J7.1 R15.1 R16.2
J8_1: D8.2 J8.1 R17.1 R18.2
J9_1: D9.2 J9.1 R19.1 R20.2
J10_1: D10.2 J10.1 R21.1 R22.2
J11_1: D11.2 J11.1 R23.1 R24.2
J13_1: D13.2 J13.1 R30.2 R31.1
KEY0: C4.2 R3.2 U1.13
KEY1: C5.2 R6.2 U1.14
KEY2: C6.2 R8.2 U1.15
KEY3: C7.2 R10.2 U1.16
KEY4: C8.2 R12.2 U1.17
KEY5: C9.2 R14.2 U1.19
KEY6: C10.2 R15.2 U1.6
KEY7: C11.2 R17.2 U1.5
KEY8: C12.2 R19.2 U1.4
KEY9: C13.2 R21.2 U1.3
KEY10: C14.2 R23.2 U1.2
KEY11: C15.2 R26.2 U1.1
KEY12: C17.2 R31.2 U1.20
LED: LED2.2 U1.9
LED2_1: LED2.1 R27.1
R1_2: C16.1 R1.2 R2.2
R6_1: D2.2 J2.1 R5.2 R6.1
R8_1: D3.2 J3.1 R7.2 R8.1
R10_1: D4.2 J4.1 R9.2 R10.1
R12_1: D5.2 J5.1 R11.2 R12.1
R14_1: D6.2 J6.1 R13.2 R14.1
R26_1: D12.2 J12.1 R25.2 R26.1
R28_2: C16.2 R28.2
R32_2: R32.2 USB1.3
R33_2: R33.2 USB1.4
RXD: H2.2 U1.11
SOUND: R1.1 U1.18
TXD: H2.3 U1.12
U2_4: R28.1 R29.2 U2.4
WAVE: D1.1 D2.1 D3.1 D4.1 D5.1 D6.1 D7.1 D8.1 D9.1 D10.1 D11.1 D12.1 D13.1 R4.1 R5.1 R7.1 R9.1 R11.1 R13.1 R16.1 R18.1 R20.1 R22.1 R24.1 R25.1 R30.1 U1.7

## Via types
v1: diameter 0.61, hole 0.305, Top Layer to Bottom Layer, 47 vias

## Routing (per net, layer and track width the routed paths; a pad name or vN(x,y) marks a point on that pad's centre or on a via; arc(x,y) is an arc through that point)
GND:
  vias: v1(6.35,54.86) v1(14.61,54.74) v1(21.97,54.86) v1(29.72,54.74) v1(37.72,54.86) v1(43.69,53.34) v1(45.21,59.56) v1(51.82,54.1) v1(59.69,54.36) v1(63.75,67.69) v1(67.18,54.36) v1(70.99,64.26) v1(75.31,54.36) v1(76.07,66.93) v1(83.06,54.48) v1(86.49,60.71) v1(90.55,53.59)
VCC: length 66.1
  Top Layer w0.254: H2.1 45.34,68.71 R27.2
  Top Layer w0.4: v1(63.25,69.72) 70.49,69.72 71.12,69.09 71.12,66.8 72.26,65.66 76.58,65.66 76.96,66.04 85.4,66.04 C1.2 87.06,66.24 87.76,66.93 F1.2 ; 42.27,60.5 42.27,59.06 42.61,58.72 42.61,58.04
  Bottom Layer w0.4: 42.27,59.06 45.34,62.13 H2.1 ; v1(63.25,69.72) 61.72,68.2 45.34,68.2
  vias: v1(42.26,59.06)
C3_1: length 4.3
  Top Layer w0.254: U2.2 68.41,65.66 67.18,65.66 66.74,66.1 65.53,66.1
F1_1: length 10.4
  Top Layer w0.4: 93.4,60.2 94.75,60.2 95.12,60.58 95.12,62.74 94.62,63.24 92.21,63.24 90.81,64.64 F1.1
H1_1: length 4.8
  Top Layer w0.4: 73.82,68.2 77.34,68.2 H1.1
H1_2: length 7.3
  Top Layer w0.254: R29.1 73.82,63.29 73.82,64.39
  Top Layer w0.4: 73.82,64.39 77.85,64.39 H1.2
J1_1: length 40.5
  Top Layer w0.254: v1(91.31,46.36) 91.31,47.45 D1.2 92.21,48.45 92.21,51.39
  Bottom Layer w0.254: J1.1 90.42,22.48 91.31,23.37 v1(91.31,46.36)
J7_1: length 17.9
  Top Layer w0.254: 45.31,51.39 45.31,48.45 D7.2 v1(44.35,46.36)
  Bottom Layer w0.254: v1(44.35,46.36) 43.31,45.32 J7.1
J8_1: length 40.1
  Top Layer w0.254: 37.5,51.39 37.5,48.45 D8.2 36.52,47.47 v1(36.52,46.36)
  Bottom Layer w0.254: J8.1 36.49,46.33 v1(36.52,46.36)
J9_1: length 18
  Top Layer w0.254: 29.68,51.39 29.68,48.45 28.74,47.5 28.69,47.45 v1(28.69,46.36)
  Bottom Layer w0.254: v1(28.69,46.36) 29.84,45.2 J9.1
J10_1: length 41
  Top Layer w0.254: 21.86,51.39 21.86,48.45 20.92,47.5 20.86,47.44 v1(20.86,46.36)
  Bottom Layer w0.254: J10.1 23.01,44.21 v1(20.86,46.36)
J11_1: length 18.8
  Top Layer w0.254: 14.05,51.39 14.05,48.45 D11.2 13.04,47.43 v1(13.04,46.36)
  Bottom Layer w0.254: v1(13.04,46.36) 16.13,43.26 J11.1
J13_1: length 13.7
  Top Layer w0.254: 22.61,65.65 19.36,65.65 18.42,66.6 18.37,66.55 v1(17.14,66.55)
  Bottom Layer w0.254: v1(17.14,66.55) 15.6,65 J13.1
KEY0: length 60
  Top Layer w0.254: 93.72,51.39 93.67,51.44 C4.2 93.67,54.54 93.09,55.12 86.36,55.12 83.06,58.42 54.99,58.42 48.51,64.9 42.54,64.9 42.27,65.18 42.27,66.24
KEY1: length 53
  Top Layer w0.254: 41.62,66.24 41.62,65.06 42.29,64.39 48.13,64.39 54.74,57.78 82.68,57.78 85.85,54.61 85.85,51.44 85.9,51.39
KEY2: length 45.8
  Top Layer w0.254: 78.08,51.39 78.04,51.44 C6.2 78.04,54.42 75.31,57.15 54.48,57.15 47.75,63.88 42.04,63.88 40.97,64.95 U1.15
KEY3: length 38.7
  Top Layer w0.254: 70.27,51.39 70.22,51.44 70.22,54.49 68.2,56.52 54.36,56.52 47.5,63.37 41.78,63.37 40.31,64.84 U1.16
KEY4: length 31.6
  Top Layer w0.254: U1.17 39.66,64.73 41.53,62.86 47.12,62.86 54.1,55.88 60.96,55.88 62.41,54.43 62.41,51.44 62.45,51.39
KEY5: length 24.9
  Top Layer w0.254: 54.64,51.39 54.59,51.44 C9.2 54.59,54.5 46.74,62.36 41.15,62.36 38.36,65.14 U1.19
KEY6: length 14.4
  Top Layer w0.254: 46.82,51.39 46.77,51.44 C10.2 46.77,54.06 46.23,54.61 41.4,54.61 40.97,55.05 40.97,60.5
KEY7: length 9.7
  Top Layer w0.254: 40.31,60.5 40.31,54.57 C11.2 38.96,51.44 39,51.39
KEY8: length 14.4
  Top Layer w0.254: 39.66,60.5 39.66,58.71 36.32,55.37 33.3,55.37 31.14,53.21 31.14,51.44 31.19,51.39
KEY9: length 21.4
  Top Layer w0.254: 39.01,60.5 39.01,59.08 35.94,56.01 26.12,56.01 C13.2 23.33,51.44 23.37,51.39
KEY10: length 28.4
  Top Layer w0.254: 15.56,51.39 15.51,51.44 C14.2 18.94,56.64 35.69,56.64 38.36,59.32 38.36,60.5
KEY11: length 35.3
  Top Layer w0.254: 37.71,60.5 37.71,59.81 35.18,57.28 15.37,57.28 11.3,53.21 7.69,53.21 7.69,51.44 7.74,51.39
KEY12: length 16.4
  Top Layer w0.254: U1.20 37.71,65.53 36.38,64.2 C17.2 22.66,64.2 22.61,64.14
LED: length 19.4
  Top Layer w0.254: 42.92,60.5 v1(42.93,61.72)
  Bottom Layer w0.254: v1(42.93,61.72) 44.07,62.86 44.07,70.99 44.58,71.5 50.67,71.5 51.05,71.12 51.05,70
LED2_1: length 2.8
  Top Layer w0.254: v1(48.01,68.96) 48.01,67.57 R27.1
  Bottom Layer w0.254: v1(48.01,68.96) 48.01,69.06 48.95,70
R1_2: length 4.2
  Top Layer w0.254: 61.59,64.4 63.5,64.4 63.5,62.17 63.43,62.1
R6_1: length 17.6
  Top Layer w0.254: v1(83.48,46.36) 83.48,47.46 83.45,47.5 84.39,48.45 84.39,51.39
  Bottom Layer w0.254: v1(83.48,46.36) 83.82,46.02 J2.1
R8_1: length 40.6
  Top Layer w0.254: 76.58,51.39 76.58,48.45 D3.2 75.66,47.47 75.66,46.36
  Bottom Layer w0.254: 76.94,11.68 76.94,45.07 75.66,46.36
  vias: v1(75.66,46.36)
R10_1: length 18.4
  Top Layer w0.254: v1(67.83,46.36) D4.2 68.76,48.45 68.76,51.39
  Bottom Layer w0.254: J4.1 70.1,44.08 v1(67.83,46.36)
R12_1: length 41.5
  Top Layer w0.254: 60.94,51.39 60.94,48.45 D5.2 v1(60,46.36)
  Bottom Layer w0.254: v1(60,46.36) 60,24.96 63.46,21.51 63.46,11.68
R14_1: length 41
  Top Layer w0.254: 53.13,51.39 53.13,48.45 D6.2 v1(52.17,46.36)
  Bottom Layer w0.254: v1(52.17,46.36) 52.17,24.36 49.97,22.16 J6.1
R26_1: length 41.9
  Top Layer w0.254: v1(5.21,46.36) 5.21,47.42 5.29,47.5 6.23,48.45 6.23,51.39
  Bottom Layer w0.254: J12.1 9.53,20.32 5.21,24.64 v1(5.21,46.36)
R28_2: length 2.1
  Top Layer w0.254: 64.84,62.1 66.94,62.1
R32_2: length 3.4
  Top Layer w0.254: 93.4,61.22 92.08,61.22 91.31,60.45 90.29,60.45
R33_2: length 3.1
  Top Layer w0.254: 93.4,62.22 90.29,62.23
RXD: length 4.1
  Top Layer w0.254: 43.57,66.24 43.57,67.69 42.8,68.45 H2.2
SOUND: length 30.6
  Top Layer w0.254: 61.59,65.91 55.24,72.26 40.13,72.26 39.01,71.15 39.01,66.24
TXD: length 4.8
  Top Layer w0.254: H2.3 42.92,67.32 U1.12
U2_4: length 5
  Top Layer w0.254: U2.4 68.41,62.13 68.45,62.1 R29.2
WAVE: length 155.6
  Top Layer w0.254: D11.1 15.56,48.45 15.56,49.61 ; D3.1 78.08,48.45 78.08,49.61 ; D10.1 23.37,48.45 23.37,49.61 ; D12.1 7.74,48.45 7.74,49.61 ; D1.1 93.72,48.45 93.72,49.61 ; 39,49.61 39,48.45 39.95,47.5 ; 55.58,47.5 54.64,48.45 54.64,49.61 ; 47.77,47.5 46.82,48.45 46.82,49.61 ; 70.27,49.61 70.27,48.45 71.22,47.5 ; v1(41.66,55.37) 41.62,55.41 41.62,61.51 41.28,61.85 21.84,61.85 20.7,62.99 20.7,64.14 19.36,64.14 18.42,63.2 ; 62.45,49.61 62.45,48.45 63.4,47.5 ; D9.1 31.19,48.45 31.19,49.61 ; 85.9,49.61 85.9,48.45 D2.1
  Bottom Layer w0.254: v1(39,48.44) 39,52.72 v1(41.66,55.37) ; v1(93.72,48.44) v1(7.74,48.44)
  vias: v1(15.55,48.44) v1(23.37,48.44) v1(31.19,48.44) v1(46.82,48.44) v1(54.64,48.44) v1(62.45,48.58) v1(70.27,48.44) v1(78.09,48.44) v1(85.9,48.44)

## Copper pours and planes (outline as drawn; the poured copper is in the pictures)
GND on Top Layer: -2.54,52.7 101.73,52.7 101.73,74.42 101.09,75.06 24.38,75.06 24.26,75.18 24.26,60.83 21.84,58.42 15.24,58.42 12.7,55.88 -2.29,55.88 -2.54,55.63
GND on Bottom Layer: -0.89,52.7 100.33,52.7 100.33,73.79 97.92,76.2 25.4,76.2 24.26,75.06 24.26,60.83 21.84,58.42 16.64,58.42 14.1,55.88 -0.89,55.88

Small or netless copper shapes (teardrops, artwork), in the pictures only: 233 on Top Layer, 55 on Bottom Layer
